# EAGLE design RAB_v11 (EAGLE 9.3.2)

## Sheet 1 of 5
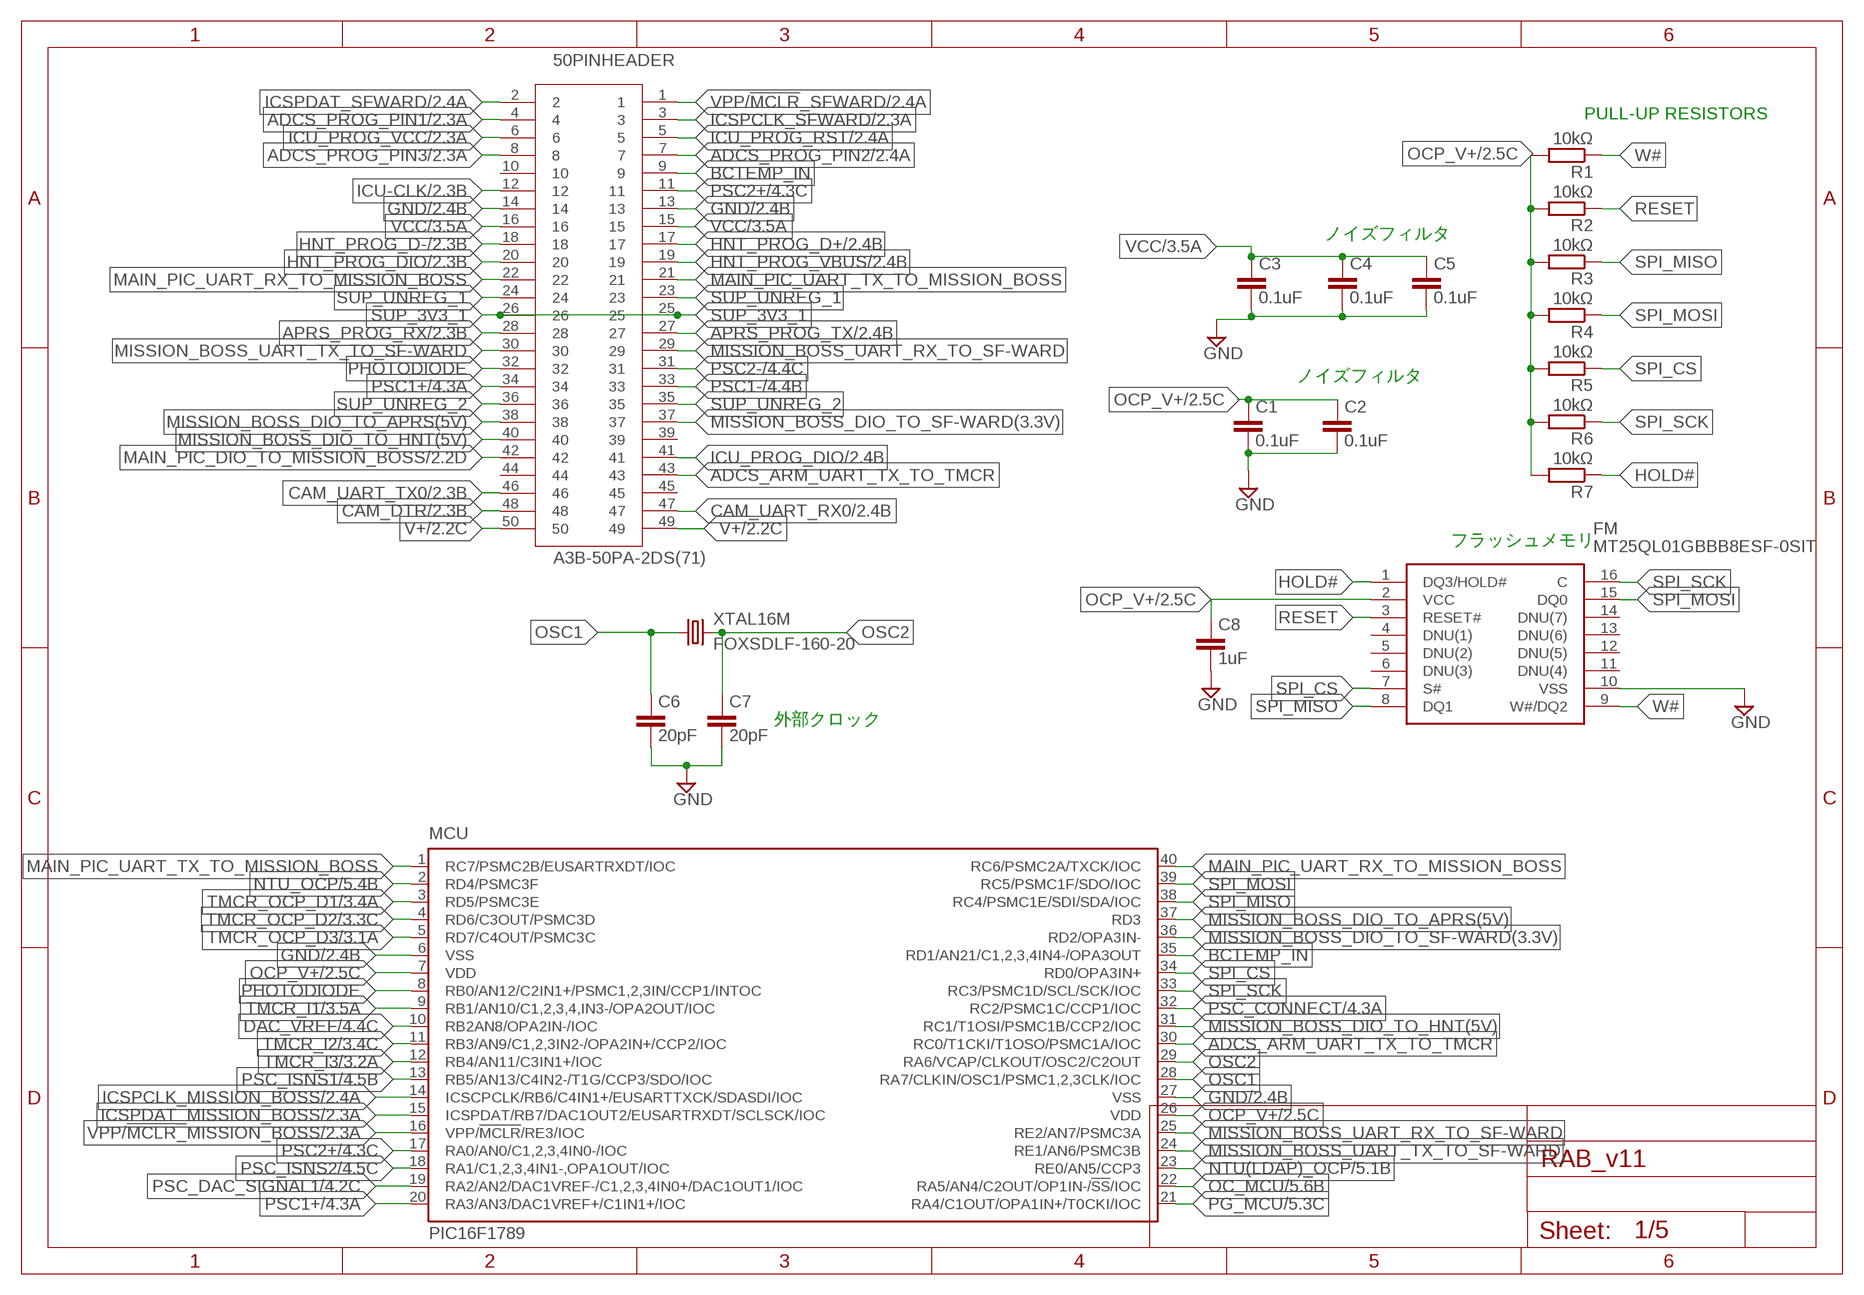
[diagram p0: schematic, sheet 1]

### Parts
50PINHEADER  A3B-50PA-2DS(71)  [A3B-50PA-2DS(71)]
C1  0.1uF  C-EUC0402  [C0402]
C2  0.1uF  C-EUC0402  [C0402]
C3  0.1uF  C-EUC0402  [C0402]
C4  0.1uF  C-EUC0402  [C0402]
C5  0.1uF  C-EUC0402  [C0402]
C6  20pF  C-EUC0402  [C0402]
C7  20pF  C-EUC0402  [C0402]
C8  1uF  C-EUC0402  [C0402]
FM  MT25QL01GBBB8ESF-0SIT  [SOIC127P1032X265-16N]
MCU  PIC16F1789  [UQFN40ML5X5MM]
R1  10kΩ  R-EU_R0805  [R0805]
R2  10kΩ  R-EU_R0805  [R0805]
R3  10kΩ  R-EU_R0805  [R0805]
R4  10kΩ  R-EU_R0805  [R0805]
R5  10kΩ  R-EU_R0805  [R0805]
R6  10kΩ  R-EU_R0805  [R0805]
R7  10kΩ  R-EU_R0805  [R0805]
XTAL16M  FOXSDLF-160-20  [FOXSDLF-160-20]

### Nets
ADCS_ARM_UART_TX_TO_TMCR: 50PINHEADER.43 MCU.30(RC0/T1CKI/T1OSO/PSMC1A/IOC)
ADCS_PROG_PIN1: 50PINHEADER.4 ; also sheet 2
ADCS_PROG_PIN2: 50PINHEADER.7 ; also sheet 2
ADCS_PROG_PIN3: 50PINHEADER.8 ; also sheet 2
APRS_PROG_RX: 50PINHEADER.28 ; also sheet 2
APRS_PROG_TX: 50PINHEADER.27 ; also sheet 2
BCTEMP_IN: 50PINHEADER.9 MCU.35(RD1/AN21/C1,2,3,4IN4-/OPA3OUT)
CAM_DTR: 50PINHEADER.48 ; also sheet 2
CAM_UART_RX0: 50PINHEADER.47 ; also sheet 2
CAM_UART_TX0: 50PINHEADER.46 ; also sheet 2
DAC_VREF: MCU.10(RB2AN8/OPA2IN-/IOC) ; also sheet 4
GND: 50PINHEADER.13 50PINHEADER.14 C1.2 C2.2 C3.2 C4.2 C5.2 C6.2 C7.2 C8.2 FM.10(VSS) MCU.6(VSS) MCU.27(VSS) ; also sheet 2,3,4,5
HNT_PROG_D+: 50PINHEADER.17 ; also sheet 2
HNT_PROG_D-: 50PINHEADER.18 ; also sheet 2
HNT_PROG_DIO: 50PINHEADER.20 ; also sheet 2
HNT_PROG_VBUS: 50PINHEADER.19 ; also sheet 2
HOLD#: FM.1(DQ3/HOLD#) R7.1
ICSPCLK_MISSION_BOSS: MCU.14(ICSCPCLK/RB6/C4IN1+/EUSARTTXCK/SDASDI/IOC) ; also sheet 2
ICSPCLK_SFWARD: 50PINHEADER.3 ; also sheet 2
ICSPDAT_MISSION_BOSS: MCU.15(ICSPDAT/RB7/DAC1OUT2/EUSARTRXDT/SCLSCK/IOC) ; also sheet 2
ICSPDAT_SFWARD: 50PINHEADER.2 ; also sheet 2
ICU-CLK: 50PINHEADER.12 ; also sheet 2
ICU_PROG_DIO: 50PINHEADER.41 ; also sheet 2
ICU_PROG_RST: 50PINHEADER.5 ; also sheet 2
ICU_PROG_VCC: 50PINHEADER.6 ; also sheet 2
MAIN_PIC_DIO_TO_MISSION_BOSS: 50PINHEADER.42 ; also sheet 2
MAIN_PIC_UART_RX_TO_MISSION_BOSS: 50PINHEADER.22 MCU.40(RC6/PSMC2A/TXCK/IOC)
MAIN_PIC_UART_TX_TO_MISSION_BOSS: 50PINHEADER.21 MCU.1(RC7/PSMC2B/EUSARTRXDT/IOC)
MISSION_BOSS_DIO_TO_APRS(5V): 50PINHEADER.38 MCU.37(RD3)
MISSION_BOSS_DIO_TO_HNT(5V): 50PINHEADER.40 MCU.31(RC1/T1OSI/PSMC1B/CCP2/IOC)
MISSION_BOSS_DIO_TO_SF-WARD(3.3V): 50PINHEADER.37 MCU.36(RD2/OPA3IN-)
MISSION_BOSS_UART_RX_TO_SF-WARD: 50PINHEADER.29 MCU.25(RE2/AN7/PSMC3A)
MISSION_BOSS_UART_TX_TO_SF-WARD: 50PINHEADER.30 MCU.24(RE1/AN6/PSMC3B)
NTU(LDAP)_OCP: MCU.23(RE0/AN5/CCP3) ; also sheet 5
NTU_OCP: MCU.2(RD4/PSMC3F) ; also sheet 5
OC_MCU: MCU.22(RA5/AN4/C2OUT/OP1IN-/!SS!/IOC) ; also sheet 5
OCP_V+: C1.1 C2.1 C8.1 FM.2(VCC) MCU.7(VDD) MCU.26(VDD) R1.2 R2.2 R3.2 R4.2 R5.2 R6.2 R7.2 ; also sheet 2,4,5
OSC1: C6.1 MCU.28(RA7/CLKIN/OSC1/PSMC1,2,3CLK/IOC) XTAL16M.1
OSC2: C7.1 MCU.29(RA6/VCAP/CLKOUT/OSC2/C2OUT) XTAL16M.2
PG_MCU: MCU.21(RA4/C1OUT/OPA1IN+/T0CKI/IOC) ; also sheet 5
PHOTODIODE: 50PINHEADER.32 MCU.8(RB0/AN12/C2IN1+/PSMC1,2,3IN/CCP1/INTOC)
PSC1+: 50PINHEADER.34 MCU.20(RA3/AN3/DAC1VREF+/C1IN1+/IOC) ; also sheet 4
PSC1-: 50PINHEADER.33 ; also sheet 4
PSC2+: 50PINHEADER.11 MCU.17(RA0/AN0/C1,2,3,4IN0-/IOC) ; also sheet 4
PSC2-: 50PINHEADER.31 ; also sheet 4
PSC_CONNECT: MCU.32(RC2/PSMC1C/CCP1/IOC) ; also sheet 4
PSC_DAC_SIGNAL1: MCU.19(RA2/AN2/DAC1VREF-/C1,2,3,4IN0+/DAC1OUT1/IOC) ; also sheet 4
PSC_ISNS1: MCU.13(RB5/AN13/C4IN2-/T1G/CCP3/SDO/IOC) ; also sheet 4
PSC_ISNS2: MCU.18(RA1/C1,2,3,4IN1-,OPA1OUT/IOC) ; also sheet 4
RESET: FM.3(RESET#) R2.1
SPI_CS: FM.7(S#) MCU.34(RD0/OPA3IN+) R5.1
SPI_MISO: FM.8(DQ1) MCU.38(RC4/PSMC1E/SDI/SDA/IOC) R3.1
SPI_MOSI: FM.15(DQ0) MCU.39(RC5/PSMC1F/SDO/IOC) R4.1
SPI_SCK: FM.16(C) MCU.33(RC3/PSMC1D/SCL/SCK/IOC) R6.1
SUP_3V3_1: 50PINHEADER.25 50PINHEADER.26
SUP_UNREG_1: 50PINHEADER.23 50PINHEADER.24
SUP_UNREG_2: 50PINHEADER.35 50PINHEADER.36
TMCR_I1: MCU.9(RB1/AN10/C1,2,3,4,IN3-/OPA2OUT/IOC) ; also sheet 3
TMCR_I2: MCU.11(RB3/AN9/C1,2,3IN2-/OPA2IN+/CCP2/IOC) ; also sheet 3
TMCR_I3: MCU.12(RB4/AN11/C3IN1+/IOC) ; also sheet 3
TMCR_OCP_D1: MCU.3(RD5/PSMC3E) ; also sheet 3
TMCR_OCP_D2: MCU.4(RD6/C3OUT/PSMC3D) ; also sheet 3
TMCR_OCP_D3: MCU.5(RD7/C4OUT/PSMC3C) ; also sheet 3
V+: 50PINHEADER.49 50PINHEADER.50 ; also sheet 2
VCC: 50PINHEADER.15 50PINHEADER.16 C3.1 C4.1 C5.1 ; also sheet 3,5
VPP/!MCLR!_MISSION_BOSS: MCU.16(VPP/!MCLR!/RE3/IOC) ; also sheet 2
VPP/!MCLR!_SFWARD: 50PINHEADER.1 ; also sheet 2
W#: FM.9(W#/DQ2) R1.1
Unconnected: 50PINHEADER.10 50PINHEADER.39 50PINHEADER.44 50PINHEADER.45 FM.4(DNU(1)) FM.5(DNU(2)) FM.6(DNU(3)) FM.11(DNU(4)) FM.12(DNU(5)) FM.13(DNU(6)) FM.14(DNU(7))

### Notes on the sheet
- PULL-UP RESISTORS
- ノイズフィルタ
- ノイズフィルタ
- フラッシュメモリ
- 外部クロック

## Sheet 2 of 5
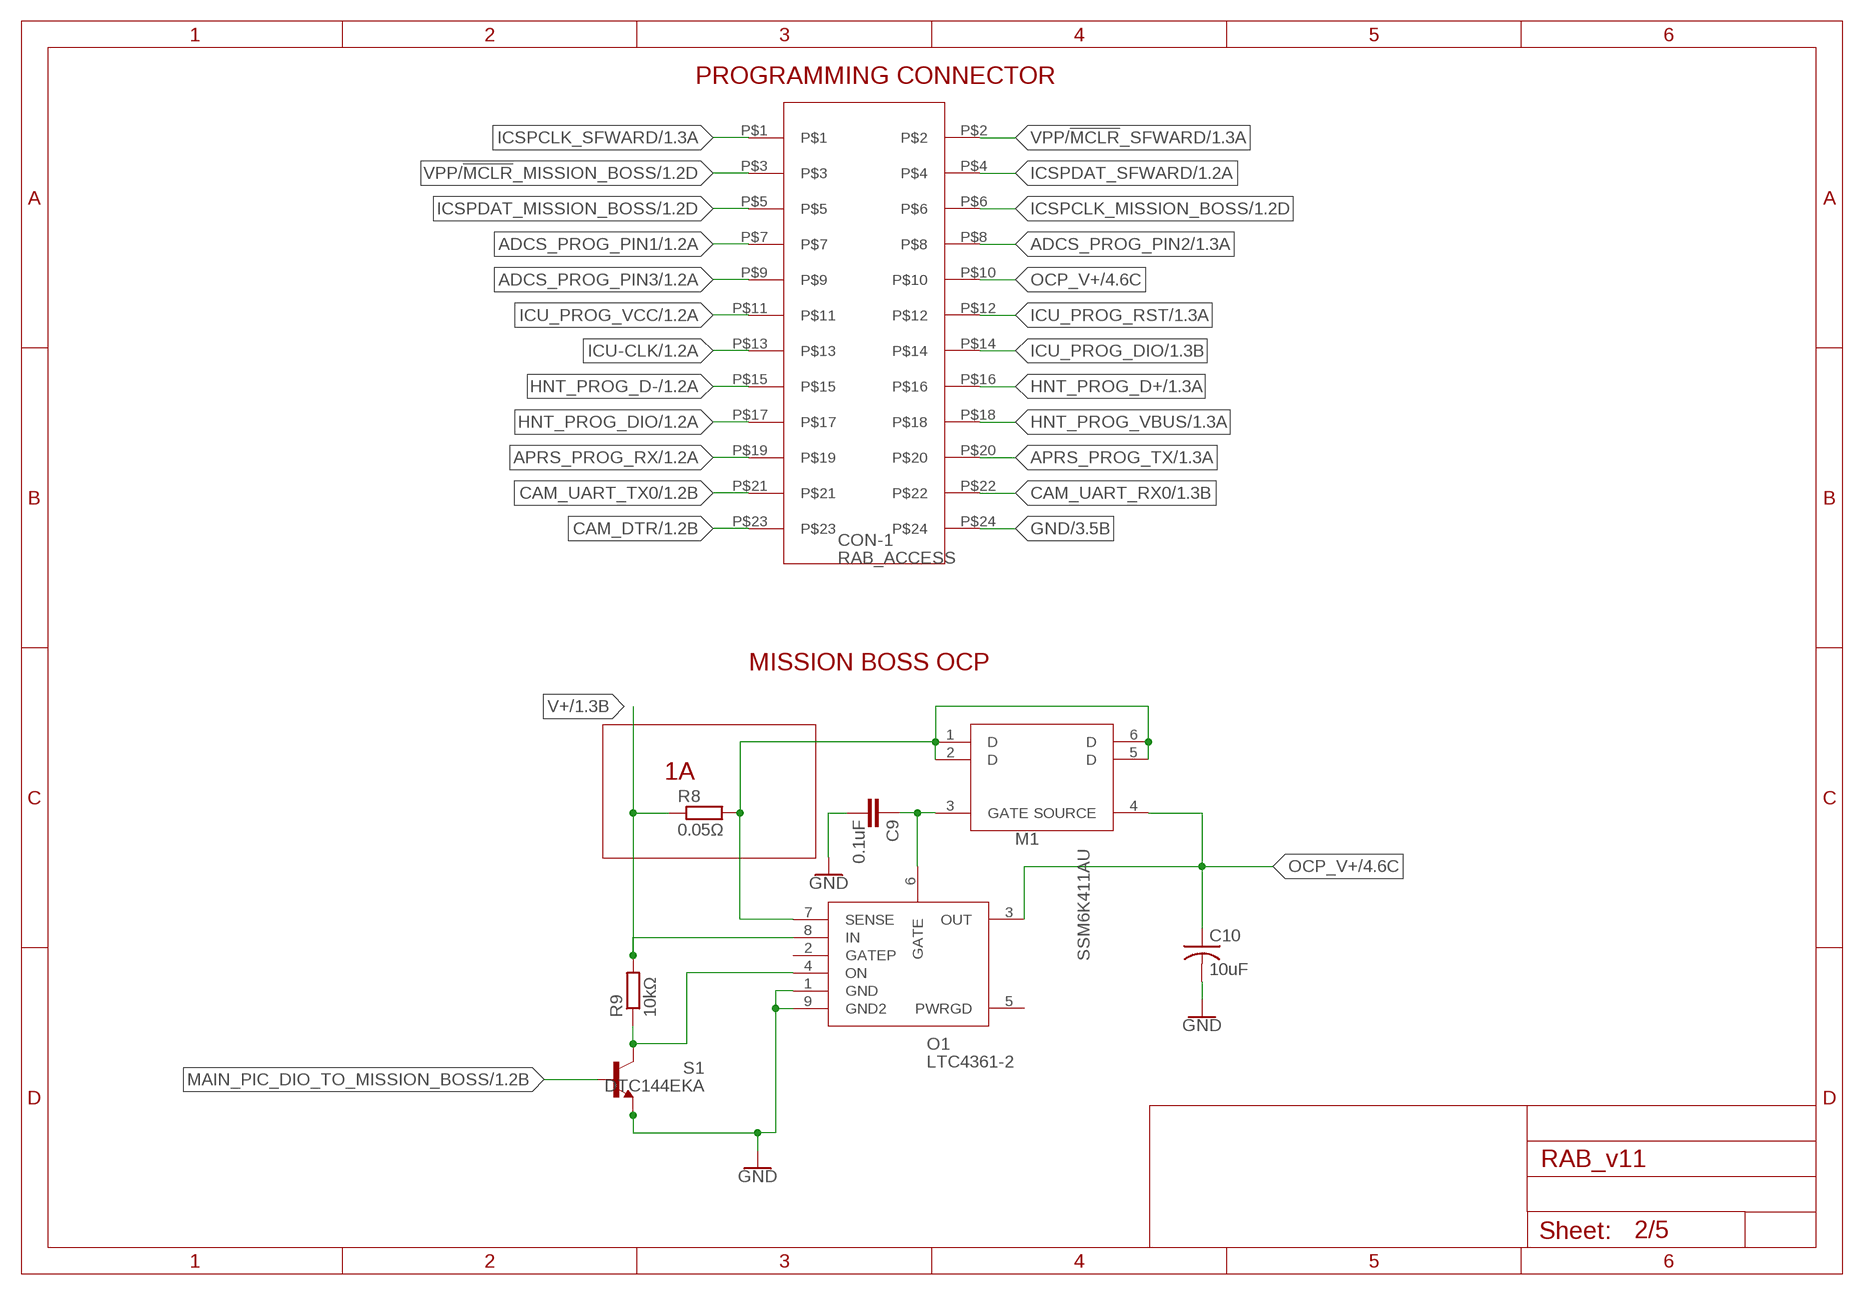
[diagram p1: schematic, sheet 2]

### Parts
C9  0.1uF  C-EUC0402  [C0402]
C10  10uF  C-USC0805  [C0805]
CON-1  RAB_ACCESS  [RAB_ACCESS]
M1  SSM6K411TU  [SSM6K411TU]
O1  LTC4361-2  [DFN]
R8  0.05Ω  R-EU_R0805  [R0805]
R9  10kΩ  R-EU_R0805  [R0805]
S1  DTC144EKA  [SOT346-R]

### Nets
ADCS_PROG_PIN1: CON-1.P$7 ; also sheet 1
ADCS_PROG_PIN2: CON-1.P$8 ; also sheet 1
ADCS_PROG_PIN3: CON-1.P$9 ; also sheet 1
APRS_PROG_RX: CON-1.P$19 ; also sheet 1
APRS_PROG_TX: CON-1.P$20 ; also sheet 1
CAM_DTR: CON-1.P$23 ; also sheet 1
CAM_UART_RX0: CON-1.P$22 ; also sheet 1
CAM_UART_TX0: CON-1.P$21 ; also sheet 1
GND: C9.2 C10.2 CON-1.P$24 O1.1(GND) O1.9(GND2) S1.1(E) ; also sheet 1,3,4,5
HNT_PROG_D+: CON-1.P$16 ; also sheet 1
HNT_PROG_D-: CON-1.P$15 ; also sheet 1
HNT_PROG_DIO: CON-1.P$17 ; also sheet 1
HNT_PROG_VBUS: CON-1.P$18 ; also sheet 1
ICSPCLK_MISSION_BOSS: CON-1.P$6 ; also sheet 1
ICSPCLK_SFWARD: CON-1.P$1 ; also sheet 1
ICSPDAT_MISSION_BOSS: CON-1.P$5 ; also sheet 1
ICSPDAT_SFWARD: CON-1.P$4 ; also sheet 1
ICU-CLK: CON-1.P$13 ; also sheet 1
ICU_PROG_DIO: CON-1.P$14 ; also sheet 1
ICU_PROG_RST: CON-1.P$12 ; also sheet 1
ICU_PROG_VCC: CON-1.P$11 ; also sheet 1
MAIN_PIC_DIO_TO_MISSION_BOSS: S1.2(B) ; also sheet 1
N$26: C9.1 M1.3(GATE) O1.6(GATE)
OCP_V+: C10.1 CON-1.P$10 M1.4(SOURCE) O1.3(OUT) ; also sheet 1,4,5
ON4: O1.4(ON) R9.1 S1.3(C)
SENSE4: M1.1(D) M1.2(D) M1.5(D) M1.6(D) O1.7(SENSE) R8.2
V+: O1.8(IN) R8.1 R9.2 ; also sheet 1
VPP/!MCLR!_MISSION_BOSS: CON-1.P$3 ; also sheet 1
VPP/!MCLR!_SFWARD: CON-1.P$2 ; also sheet 1
Unconnected: O1.2(GATEP) O1.5(PWRGD)

### Notes on the sheet
- PROGRAMMING CONNECTOR
- MISSION BOSS OCP
- 1A

## Sheet 3 of 5: TMCR
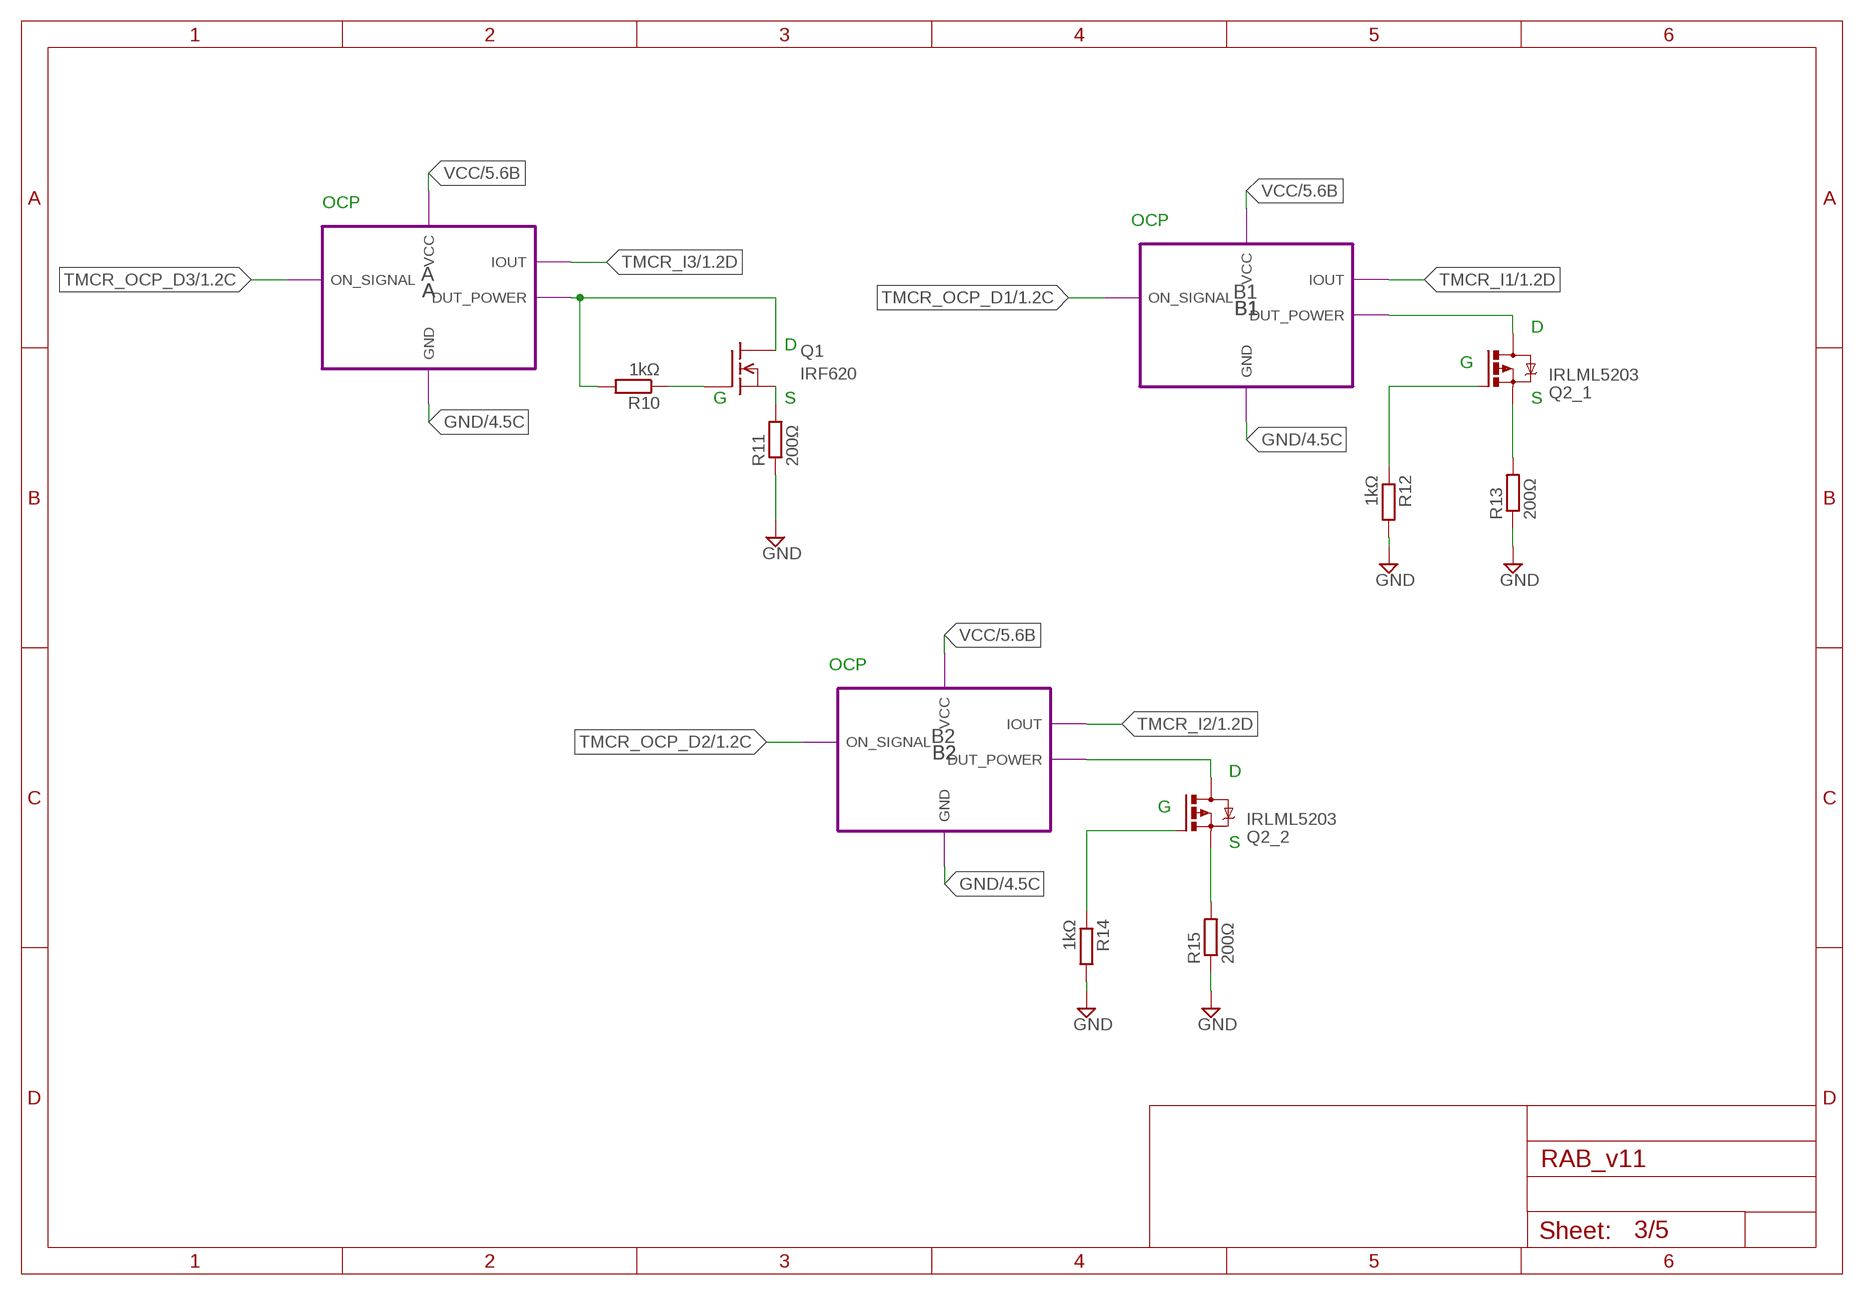
[diagram p2: schematic, sheet 3]

### Parts
Q1  IRF620  [TO220]
Q2_1  IRLML5203  [MICRO3]
Q2_2  IRLML5203  [MICRO3]
R10  1kΩ  R-EU_R0805  [R0805]
R11  200Ω  R-EU_R0805  [R0805]
R12  1kΩ  R-EU_R0805  [R0805]
R13  200Ω  R-EU_R0805  [R0805]
R14  1kΩ  R-EU_R0805  [R0805]
R15  200Ω  R-EU_R0805  [R0805]

### Module instances
A = OCP
B1 = OCP
B2 = OCP

### Nets
GND: R11.1 R12.2 R13.1 R14.2 R15.1 ; port A.GND B1.GND B2.GND ; also sheet 1,2,4,5
N$1: Q2_1.2(S) R13.2
N$2: Q2_1.1(G) R12.1
N$6: Q2_2.3(D) ; port B2.DUT_POWER
N$10: Q2_2.2(S) R15.2
N$13: Q2_2.1(G) R14.1
N$15: Q1.2(D) R10.2 ; port A.DUT_POWER
N$16: Q1.3(S) R11.2
N$17: Q1.1(G) R10.1
N$18: Q2_1.3(D) ; port B1.DUT_POWER
TMCR_I1: port B1.IOUT ; also sheet 1
TMCR_I2: port B2.IOUT ; also sheet 1
TMCR_I3: port A.IOUT ; also sheet 1
TMCR_OCP_D1: port B1.ON_SIGNAL ; also sheet 1
TMCR_OCP_D2: port B2.ON_SIGNAL ; also sheet 1
TMCR_OCP_D3: port A.ON_SIGNAL ; also sheet 1
VCC: port A.VCC B1.VCC B2.VCC ; also sheet 1,5

### Notes on the sheet
- OCP
- OCP
- D
- D
- G
- G | S | S
- OCP
- D
- G
- S

## Sheet 4 of 5: PSC
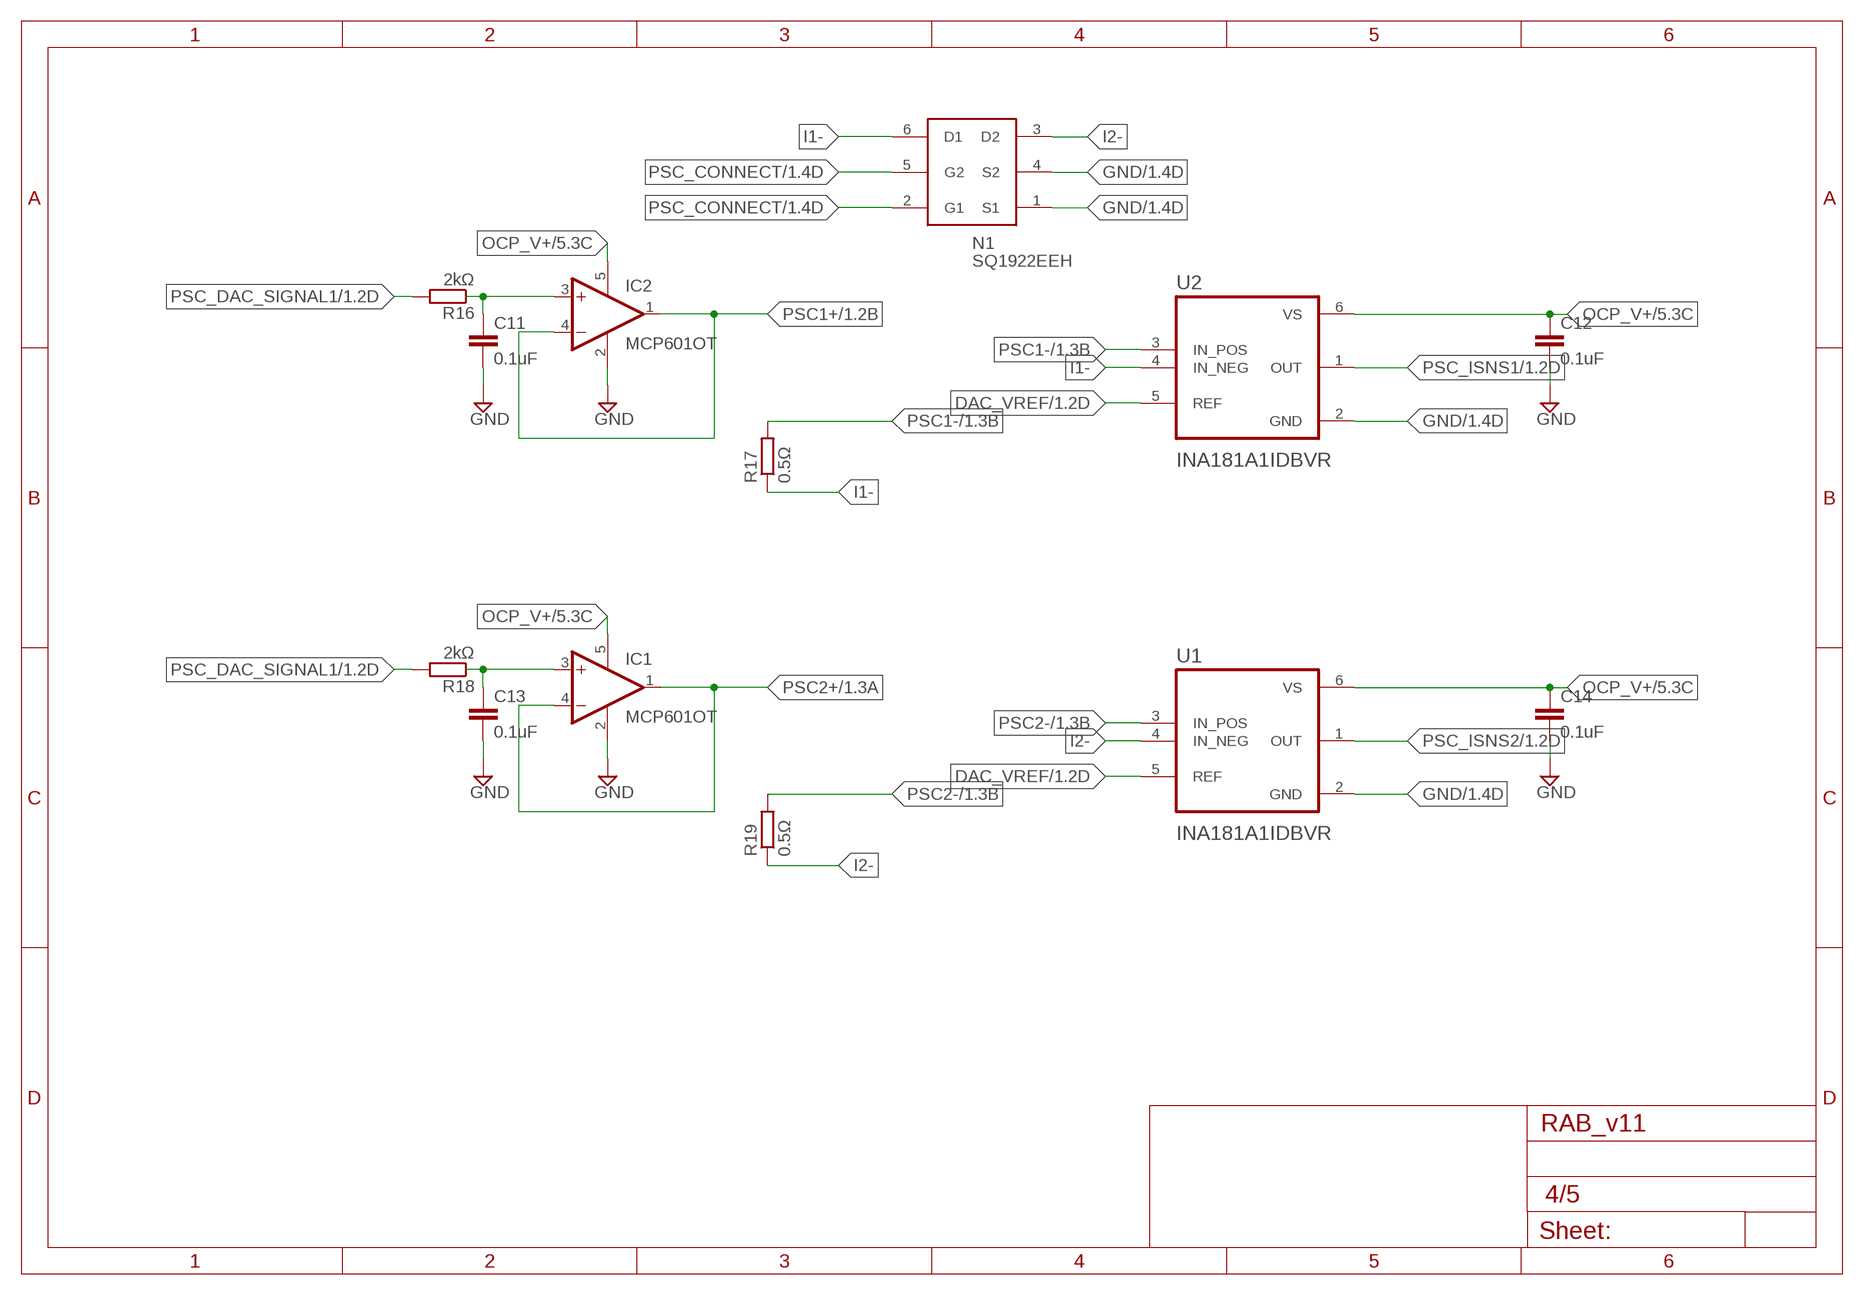
[diagram p3: schematic, sheet 4]

### Parts
C11  0.1uF  C-EUC0402  [C0402]
C12  0.1uF  C-EUC0402  [C0402]
C13  0.1uF  C-EUC0402  [C0402]
C14  0.1uF  C-EUC0402  [C0402]
IC1  MCP601OT  [SOT23-5]
IC2  MCP601OT  [SOT23-5]
N1  SQ1922EEH  [SOT65P210X110-6N]
R16  2kΩ  R-EU_R0805  [R0805]
R17  0.5Ω  R-EU_R0805  [R0805]
R18  2kΩ  R-EU_R0805  [R0805]
R19  0.5Ω  R-EU_R0805  [R0805]
U1  INA181A1IDBVR  [SOT95P280X145-6N]
U2  INA181A1IDBVR  [SOT95P280X145-6N]

### Nets
DAC_VREF: U1.5(REF) U2.5(REF) ; also sheet 1
GND: C11.2 C12.2 C13.2 C14.2 IC1.2(V-) IC2.2(V-) N1.1(S1) N1.4(S2) U1.2(GND) U2.2(GND) ; also sheet 1,2,3,5
I1-: N1.6(D1) R17.1 U2.4(IN_NEG)
I2-: N1.3(D2) R19.1 U1.4(IN_NEG)
N$3: C13.1 IC1.3(+IN) R18.1
N$4: C11.1 IC2.3(+IN) R16.1
OCP_V+: C12.1 C14.1 IC1.5(V+) IC2.5(V+) U1.6(VS) U2.6(VS) ; also sheet 1,2,5
PSC1+: IC2.1(OUT) IC2.4(-IN) ; also sheet 1
PSC1-: R17.2 U2.3(IN_POS) ; also sheet 1
PSC2+: IC1.1(OUT) IC1.4(-IN) ; also sheet 1
PSC2-: R19.2 U1.3(IN_POS) ; also sheet 1
PSC_CONNECT: N1.2(G1) N1.5(G2) ; also sheet 1
PSC_DAC_SIGNAL1: R16.2 R18.2 ; also sheet 1
PSC_ISNS1: U2.1(OUT) ; also sheet 1
PSC_ISNS2: U1.1(OUT) ; also sheet 1

## Sheet 5 of 5: NTU
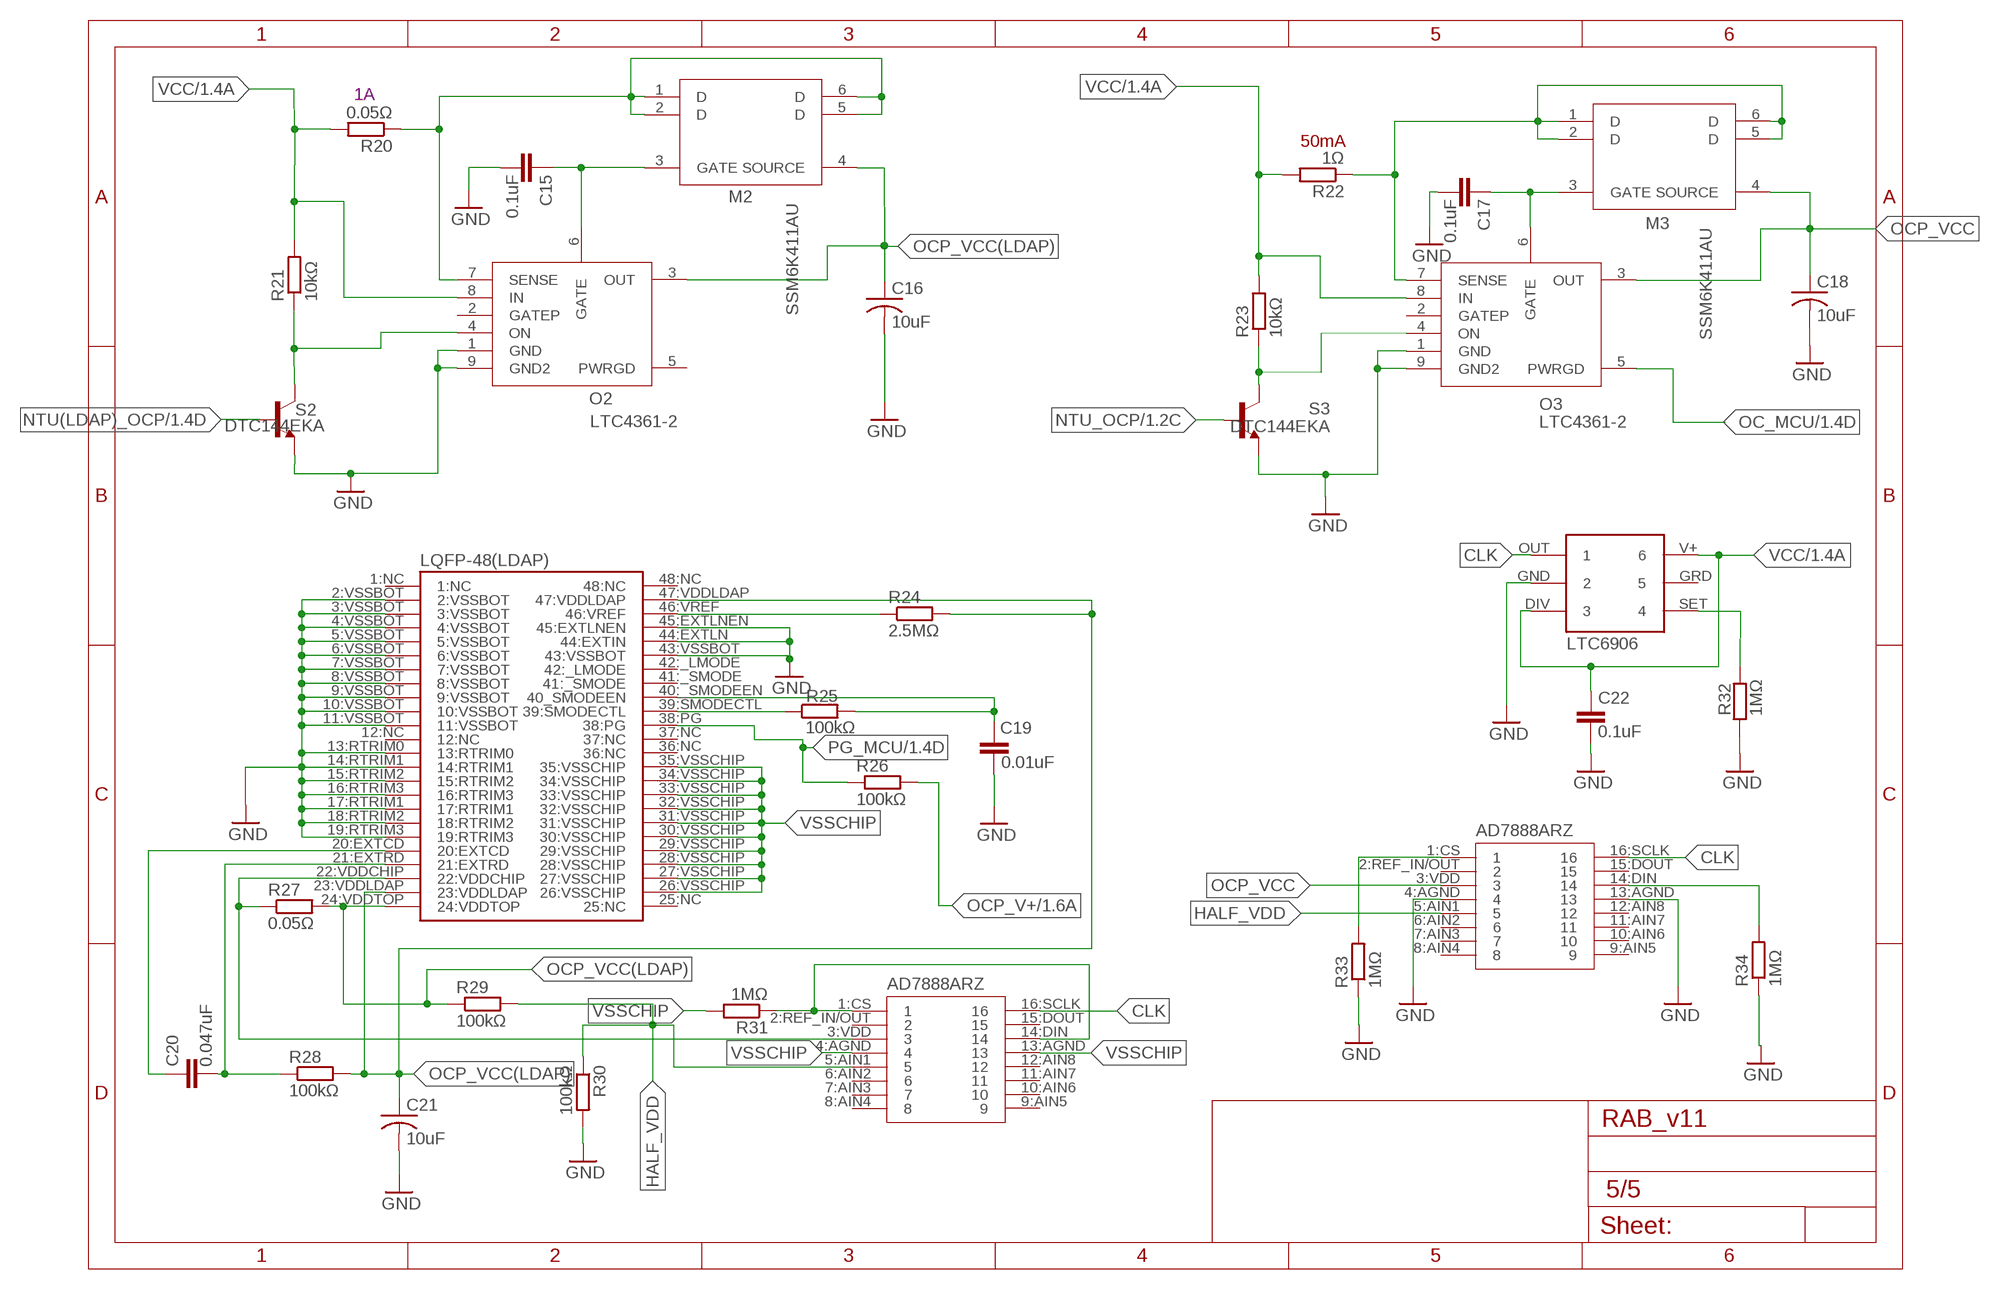
[diagram p4: schematic, sheet 5]

### Parts
ADC1  AD7888ARZ  [AD7888ARZ]
ADC2  AD7888ARZ  [AD7888ARZ]
C15  0.1uF  C-EUC0402  [C0402]
C16  10uF  C-USC0805  [C0805]
C17  0.1uF  C-EUC0402  [C0402]
C18  10uF  C-USC0805  [C0805]
C19  0.01uF  C-EUC0402  [C0402]
C20  0.047uF  C-EUC0402  [C0402]
C21  10uF  C-USC0805  [C0805]
C22  0.1uF  C-EUC0402  [C0402]
CLCK  LTC6906  [LTC6906]
LDAP  LQFP-48  [LQFP-48]
M2  SSM6K411TU  [SSM6K411TU]
M3  SSM6K411TU  [SSM6K411TU]
O2  LTC4361-2  [DFN]
O3  LTC4361-2  [DFN]
R20  0.05Ω  R-EU_R0805  [R0805]
R21  10kΩ  R-EU_R0805  [R0805]
R22  1Ω  R-EU_R0805  [R0805]
R23  10kΩ  R-EU_R0805  [R0805]
R24  2.5MΩ  R-EU_R0805  [R0805]
R25  100kΩ  R-EU_R0805  [R0805]
R26  100kΩ  R-EU_R0805  [R0805]
R27  0.05Ω  R-EU_R0805  [R0805]
R28  100kΩ  R-EU_R0805  [R0805]
R29  100kΩ  R-EU_R0805  [R0805]
R30  100kΩ  R-EU_R0805  [R0805]
R31  1MΩ  R-EU_R0805  [R0805]
R32  1MΩ  R-EU_R0805  [R0805]
R33  1MΩ  R-EU_R0805  [R0805]
R34  1MΩ  R-EU_R0805  [R0805]
S2  DTC144EKA  [SOT346-R]
S3  DTC144EKA  [SOT346-R]

### Nets
CLK: ADC1.16:SCLK ADC2.16:SCLK CLCK.OUT
GND: ADC2.4:AGND ADC2.13:AGND C15.2 C16.2 C17.2 C18.2 C19.2 C21.2 C22.2 CLCK.GND LDAP.2:VSSBOT LDAP.3:VSSBOT LDAP.4:VSSBOT LDAP.5:VSSBOT LDAP.6:VSSBOT LDAP.7:VSSBOT LDAP.8:VSSBOT LDAP.9:VSSBOT LDAP.10:VSSBOT LDAP.11:VSSBOT LDAP.13:RTRIM0 LDAP.14:RTRIM1 LDAP.15:RTRIM2 LDAP.16:RTRIM3 LDAP.17:RTRIM1 LDAP.18:RTRIM2 LDAP.19:RTRIM3 LDAP.43:VSSBOT LDAP.44:EXTLN(44:EXTIN) LDAP.45:EXTLNEN O2.1(GND) O2.9(GND2) O3.1(GND) O3.9(GND2) R30.2 R32.1 R33.1 R34.1 S2.1(E) S3.1(E) ; also sheet 1,2,3,4
HALF_VDD: ADC1.5:AIN1 ADC2.5:AIN1 R29.2 R30.1
N$5: ADC2.1:CS R33.2
N$7: CLCK.SET R32.2
N$8: ADC2.14:DIN R34.2
N$9: O3.4(ON) R23.1 S3.3(C)
N$11: C17.1 M3.3(GATE) O3.6(GATE)
N$12: ADC1.1:CS ADC1.14:DIN R31.1
N$19: LDAP.39:SMODECTL R25.1
N$20: C19.1 LDAP.40:_SMODEEN(40_SMODEEN) R25.2
N$21: M3.1(D) M3.2(D) M3.5(D) M3.6(D) O3.7(SENSE) R22.1
N$22: C15.1 M2.3(GATE) O2.6(GATE)
N$23: M2.1(D) M2.2(D) M2.5(D) M2.6(D) O2.7(SENSE) R20.1
N$27: LDAP.46:VREF R24.1
N$28: C20.1 LDAP.20:EXTCD
N$29: O2.4(ON) R21.1 S2.3(C)
N$31: ADC1.3:VDD LDAP.22:VDDCHIP R27.1
N$32: C20.2 LDAP.21:EXTRD R28.1
NTU(LDAP)_OCP: S2.2(B) ; also sheet 1
NTU_OCP: S3.2(B) ; also sheet 1
OC_MCU: O3.5(PWRGD) ; also sheet 1
OCP_V+: R26.2 ; also sheet 1,2,4
OCP_VCC: ADC2.3:VDD C18.1 M3.4(SOURCE) O3.3(OUT)
OCP_VCC(LDAP): C16.1 C21.1 LDAP.23:VDDLDAP LDAP.24:VDDTOP LDAP.47:VDDLDAP M2.4(SOURCE) O2.3(OUT) R24.2 R27.2 R28.2 R29.1
PG_MCU: LDAP.38:PG R26.1 ; also sheet 1
VCC: C22.1 CLCK.DIV CLCK.V+ O2.8(IN) O3.8(IN) R20.2 R21.2 R22.2 R23.2 ; also sheet 1,3
VSSCHIP: ADC1.4:AGND ADC1.13:AGND LDAP.26:VSSCHIP LDAP.27:VSSCHIP LDAP.28:VSSCHIP LDAP.29:VSSCHIP LDAP.30:VSSCHIP LDAP.31:VSSCHIP LDAP.32:VSSCHIP LDAP.33:VSSCHIP LDAP.34:VSSCHIP LDAP.35:VSSCHIP R31.2
Unconnected: ADC1.2:REF_IN/OUT ADC1.6:AIN2 ADC1.7:AIN3 ADC1.8:AIN4 ADC1.9:AIN5 ADC1.10:AIN6 ADC1.11:AIN7 ADC1.12:AIN8 ADC1.15:DOUT ADC2.2:REF_IN/OUT ADC2.6:AIN2 ADC2.7:AIN3 ADC2.8:AIN4 ADC2.9:AIN5 ADC2.10:AIN6 ADC2.11:AIN7 ADC2.12:AIN8 ADC2.15:DOUT CLCK.GRD LDAP.1:NC LDAP.12:NC LDAP.25:NC LDAP.36:NC LDAP.37:NC LDAP.41:_SMODE LDAP.42:_LMODE LDAP.48:NC O2.2(GATEP) O2.5(PWRGD) O3.2(GATEP)

### Notes on the sheet
- 1A
- 50mA

## Library data of the parts
50PINHEADER = BIRDS3_Tha_lib:A3B-50PA-2DS(71)
ADC1 ADC2 = AD7888ARZ:AD7888ARZ
C1-C9 C11-C15 C17 C19 C22 = rcl:C-EU: CAPACITOR, European symbol; SPICEPREFIX: C
C10 C16 C18 C21 = rcl:C-US: CAPACITOR, American symbol; SPICEPREFIX: C
C20 = resistor:C-EU: CAPACITOR, European symbol
CLCK = LTC6906:LTC6906
CON-1 = BIRDS_4_general_components_library:RAB_ACCESS
FM = BIRDS3_CAM_MSN:MT25QL01GBBB8ESF-0SIT: IC FLASH 1GBIT 108MHZ 16SOIC Source: Datasheet <https://www.micron.com/~/media/documents/products/data-sheet/nor-flash/serial-nor/mt25q/die-rev-b/mt25q_qlkt_l_01g_bbb_0.pdf>; DESCRIPTION: IC FLASH 1GBIT 108MHZ 16SOIC; HEIGHT: 2.65mm; MANUFACTURER_NAME: Micron; MANUFACTURER_PART_NUMBER: MT25QL01GBBB8ESF-0SIT; SUPPLIER_NAME: RS
IC1 IC2 = linear:MCP601: Single Op Amp 2.7V to 6.0V Single Supply CMOS Source: http://ww1.microchip.com/downloads/en/DeviceDoc/21314g.pdf
LDAP = LQFP-48:LQFP-48
M1-M3 = BIRDS3_Tha_lib:SSM6K411TU
MCU = microchip_edited:PIC16F1789
N1 = BIRDS3_CAM_MSN:SQ1922EEH
O1-O3 = BIRDS3_CAM_MSN:LTC4361-2
Q1 = transistor-fet:IRF620: N-Channel Enhancement MOSFET (HEXFET); 200V; 5,2A; 0,8Ohm
Q2_1 Q2_2 = transistor-power:IRLML5203: HEXFET P-Channel Power MOSFET
R1-R34 = rcl:R-EU_: RESISTOR, European symbol; SPICEPREFIX: R
S1-S3 = BIRDS3_CAM_MSN:DTC144EKA
U1 U2 = INA181A1IDBVR:INA181A1IDBVR: 26V, Bidirectional, Low- or High-Side Voltage Output Current Sense Amplifier 6-SOT-23 -40 to 125; DESCRIPTION: 26V, Bidirectional, Low- or High-Side Voltage Output Current Sense Amplifier 6-SOT-23 -40 to 125; DIGI-KEY_PART_NUMBER: 296-47656-1-ND; DIGI-KEY_PURCHASE_URL: https://www.digikey.com/product-detail/en/texas-instruments/INA181A1IDBVR/296-47656-1-ND/8133025?utm_source=snapeda&utm_medium=aggregator&utm_campaign=symbol; MF: Texas Instruments; MP: INA181A1IDBVR; PACKAGE: SOT-23 Texas Instruments
XTAL16M = BIRDS3_CAM_MSN:FOXSDLF-160-20

## Module OCP
Ports: VCC(pwr) GND(pwr) ON_SIGNAL(in) IOUT(out) DUT_POWER(out)
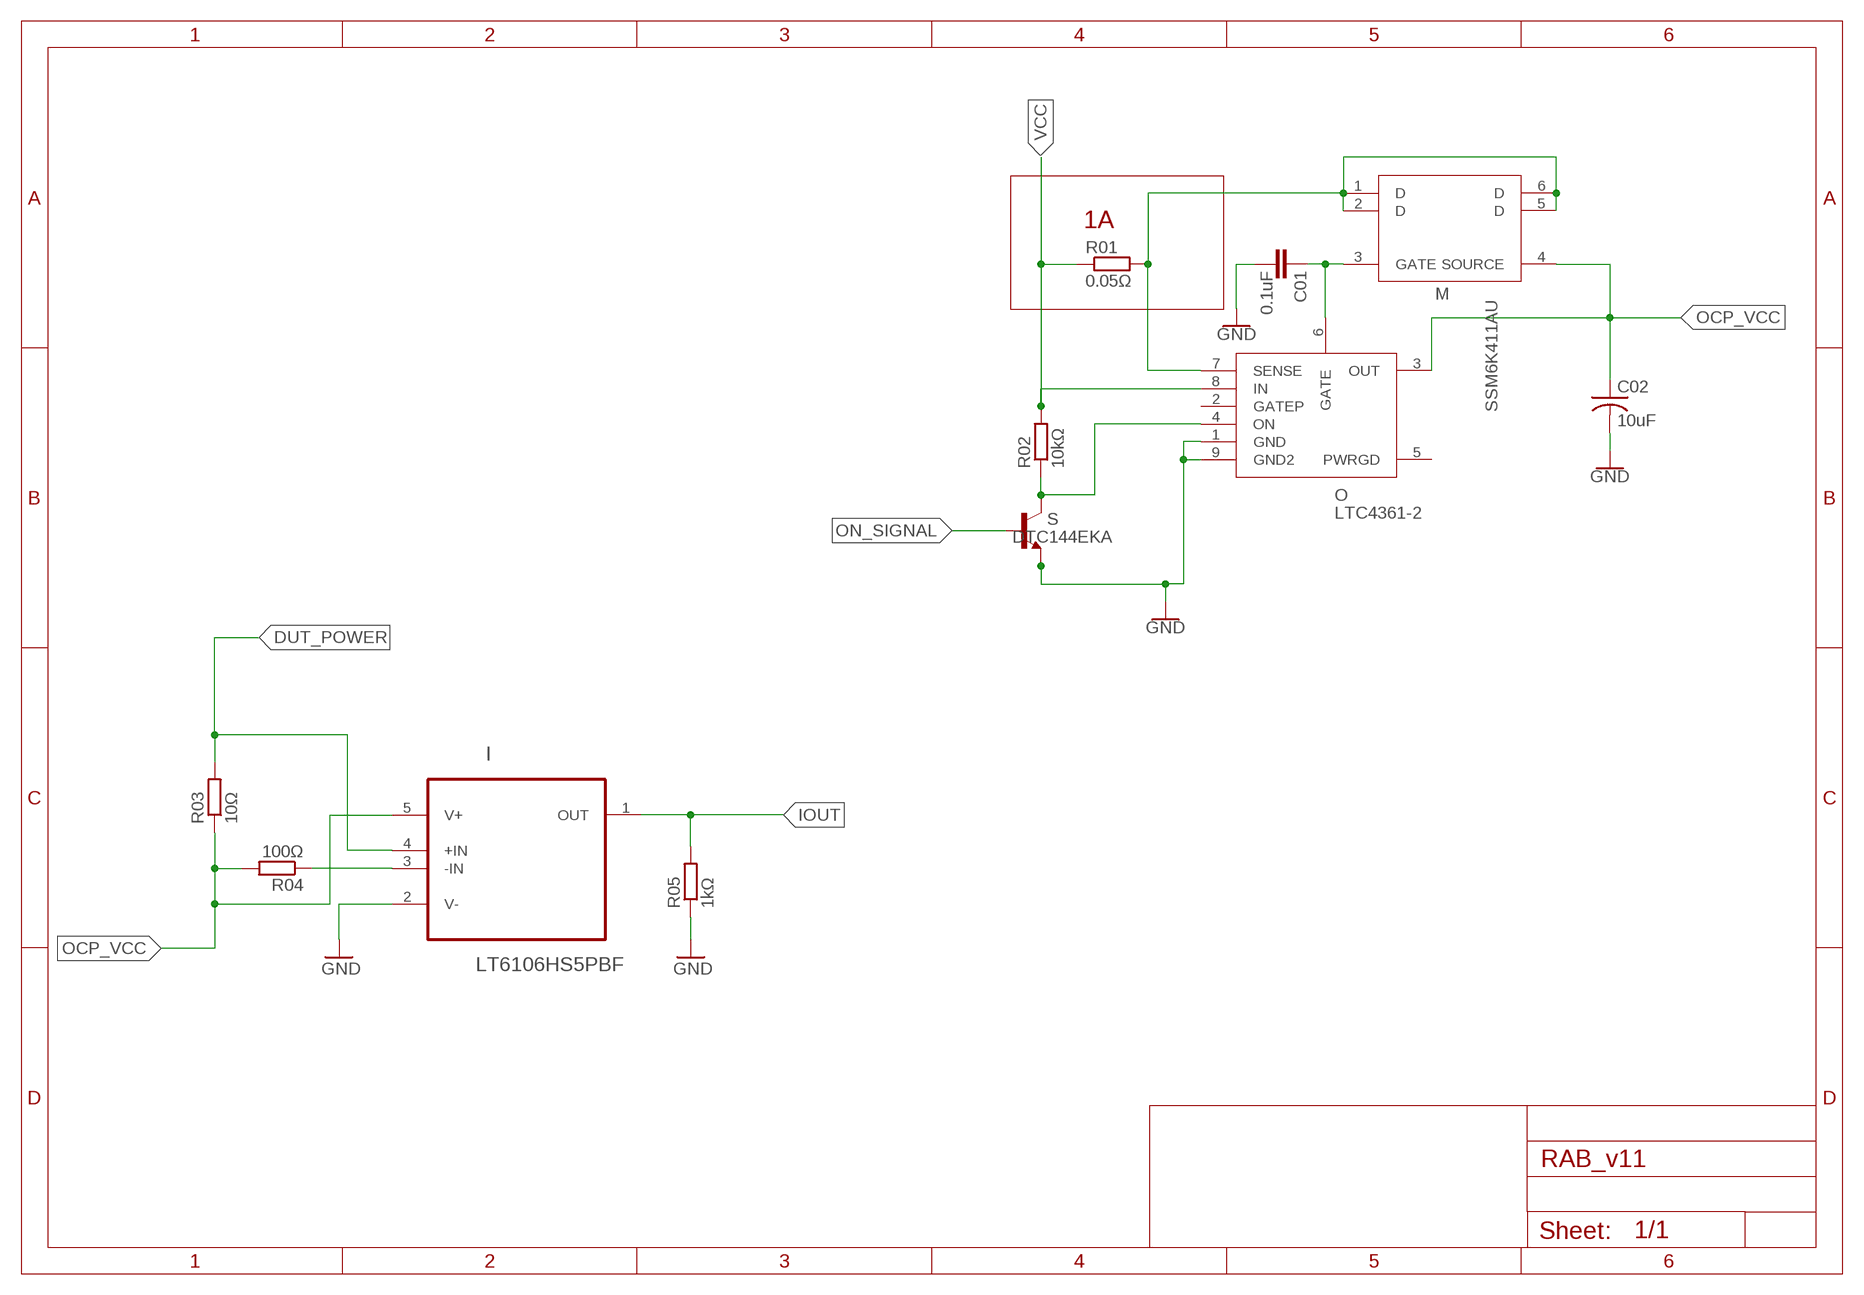
[diagram p5: schematic, module OCP, sheet 1]

### Parts
C01  0.1uF  C-EUC0402  [C0402]
C02  10uF  C-USC0805  [C0805]
I  LT6106HS5PBF  [SOT95P280X100-5N]
M  SSM6K411TU  [SSM6K411TU]
O  LTC4361-2  [DFN]
R01  0.05Ω  R-EU_R0805  [R0805]
R02  10kΩ  R-EU_R0805  [R0805]
R03  10Ω  R-EU_R0805  [R0805]
R04  100Ω  R-EU_R0805  [R0805]
R05  1kΩ  R-EU_R0805  [R0805]
S  DTC144EKA  [SOT346-R]

### Nets
DUT_POWER: I.4(+IN) R03.2
GND: C01.2 C02.2 I.2(V-) O.1(GND) O.9(GND2) R05.1 S.1(E)
IOUT: I.1(OUT) R05.2
N$2: I.3(-IN) R04.1
N$3: C01.1 M.3(GATE) O.6(GATE)
OCP_VCC: C02.1 I.5(V+) M.4(SOURCE) O.3(OUT) R03.1 R04.2
ON4: O.4(ON) R02.1 S.3(C)
ON_SIGNAL: S.2(B)
SENSE4: M.1(D) M.2(D) M.5(D) M.6(D) O.7(SENSE) R01.2
VCC: O.8(IN) R01.1 R02.2
Unconnected: O.2(GATEP) O.5(PWRGD)

### Notes on the sheet
- 1A

### Library data of the parts
C01 = rcl:C-EU: CAPACITOR, European symbol; SPICEPREFIX: C
C02 = rcl:C-US: CAPACITOR, American symbol; SPICEPREFIX: C
I = LTC_By_element14_Batch_1:LT6106HS5PBF: High Side Current Sense; MPN: LT6106HS5#PBF; OC_FARNELL: 1432117; OC_NEWARK: 61R9528; PACKAGE: TSOT-23-5; SUPPLIER: Linear Technology
M = BIRDS3_Tha_lib:SSM6K411TU
O = BIRDS3_CAM_MSN:LTC4361-2
R01-R05 = rcl:R-EU_: RESISTOR, European symbol; SPICEPREFIX: R
S = BIRDS3_CAM_MSN:DTC144EKA

## Board
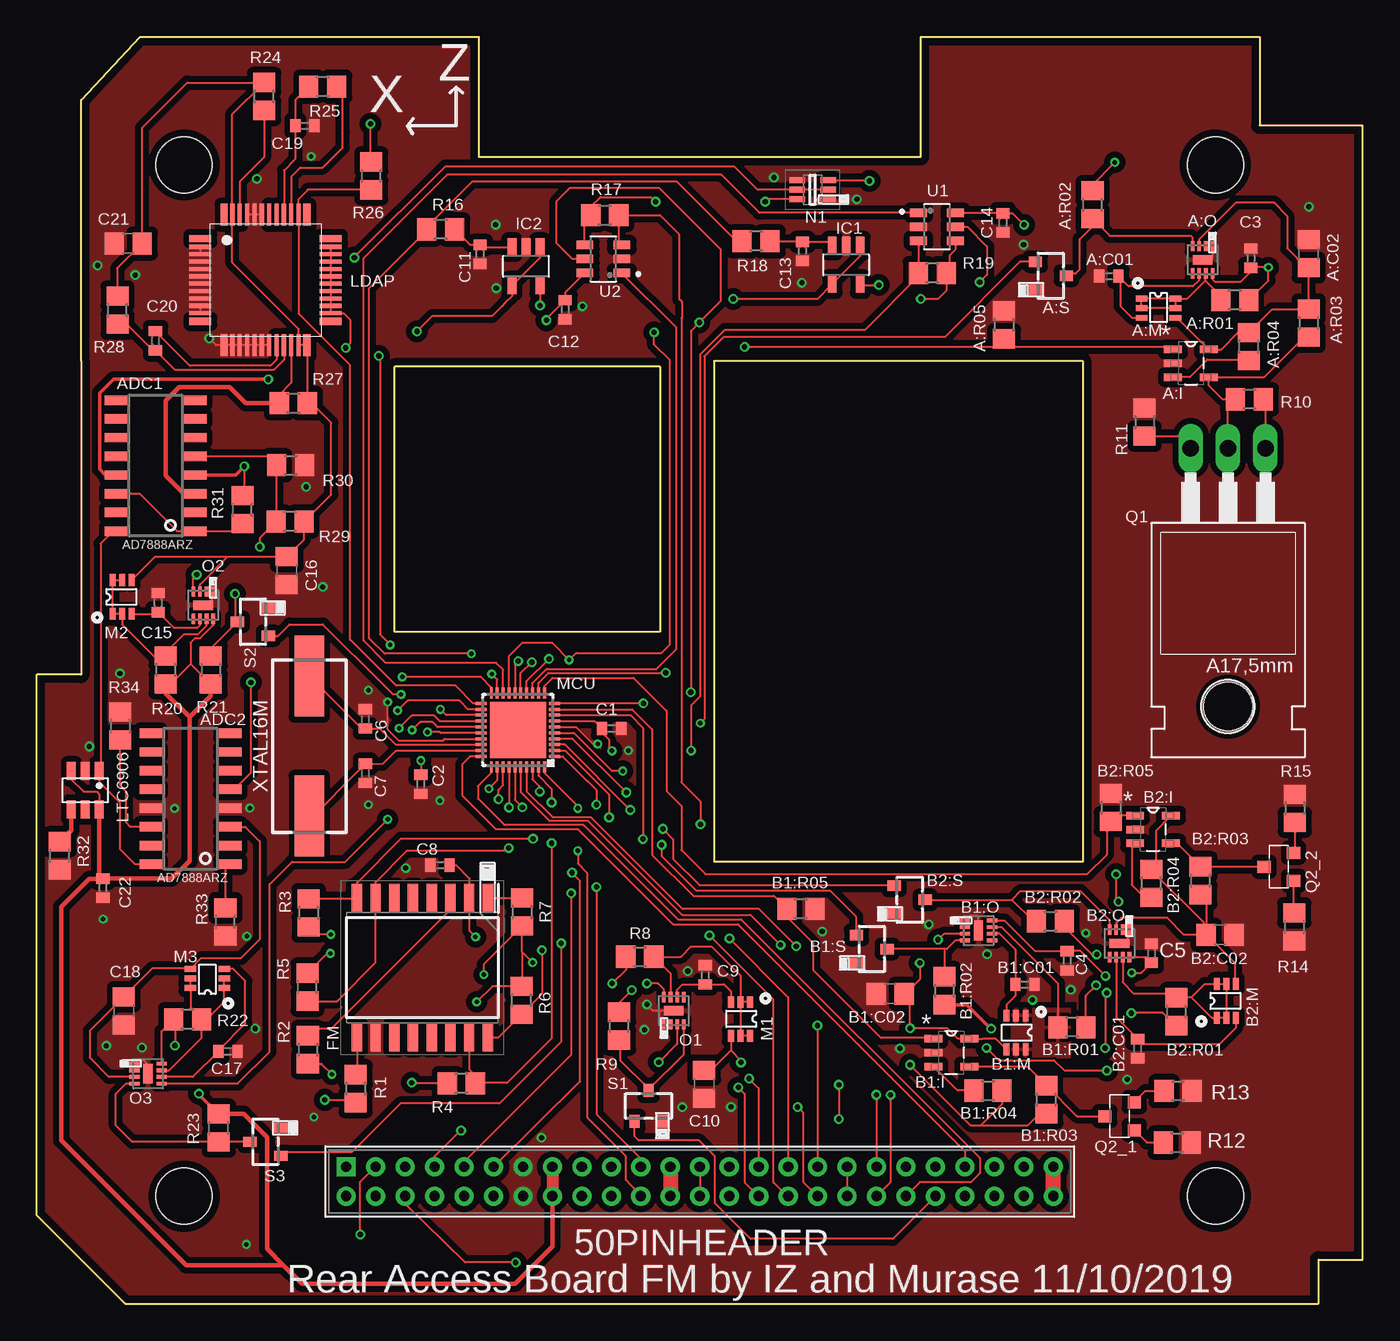
[diagram p6: board, top side]
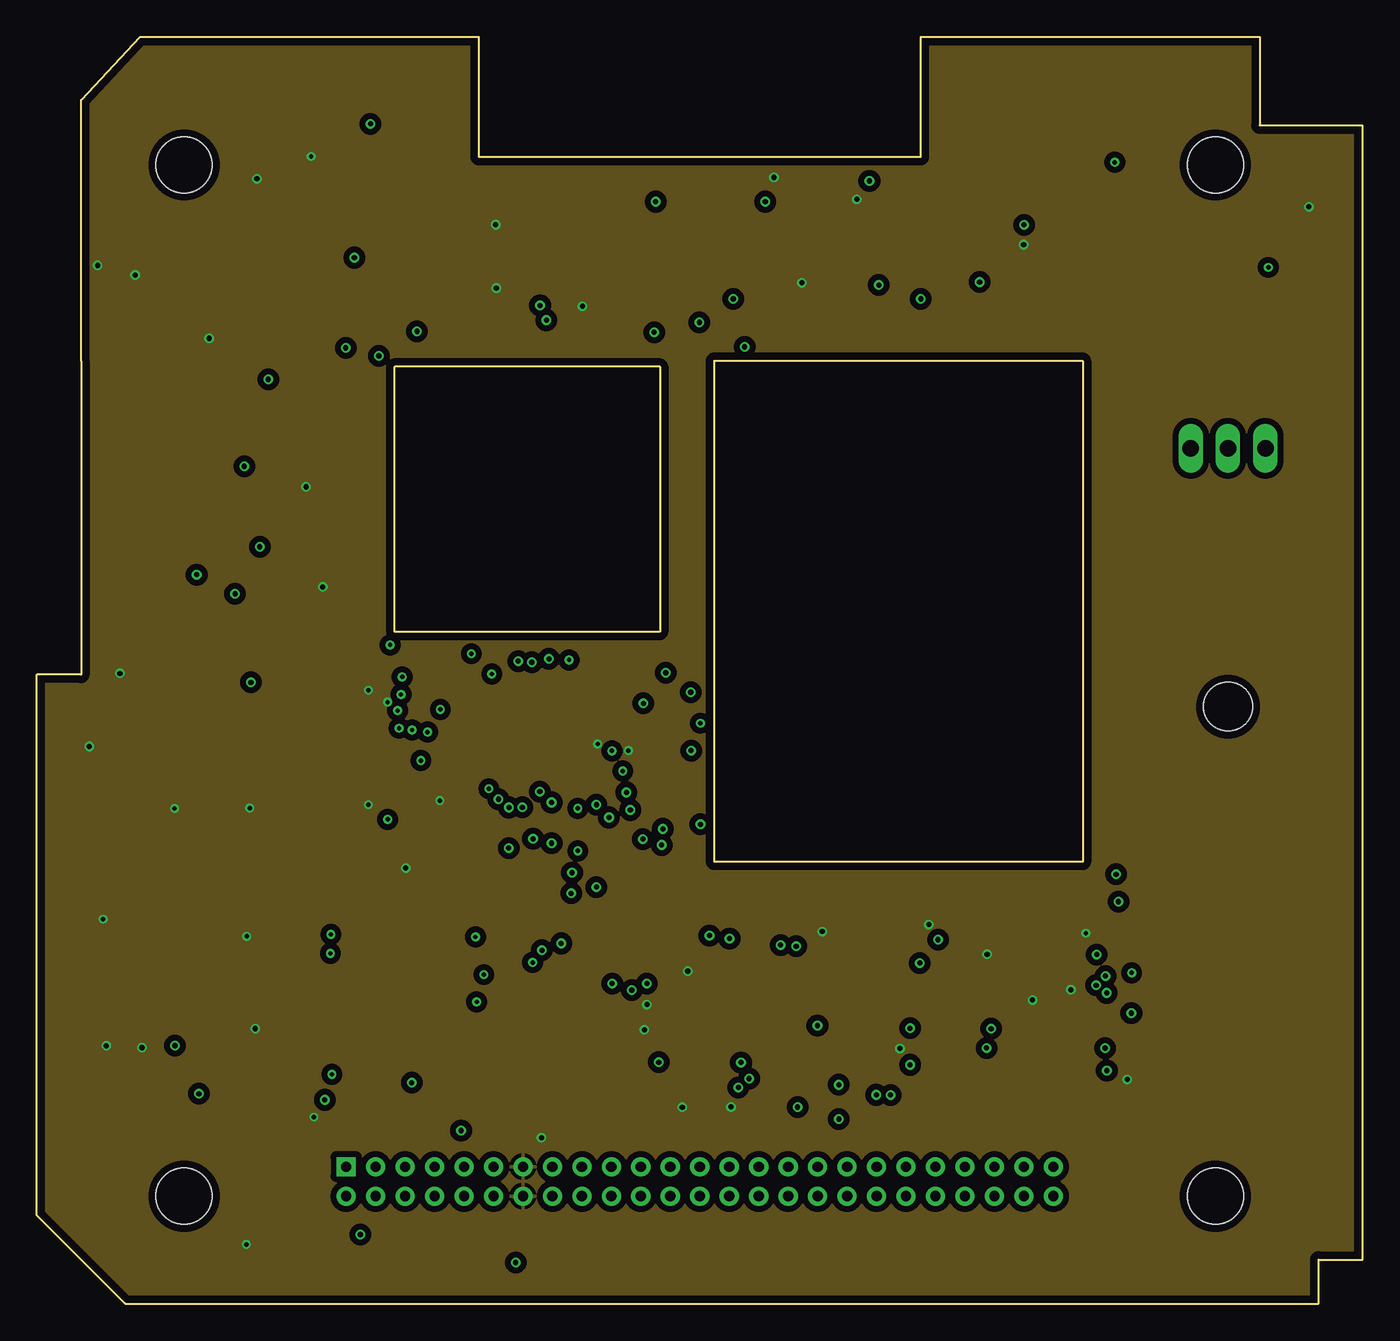
[diagram p7: board, inner layer GND]
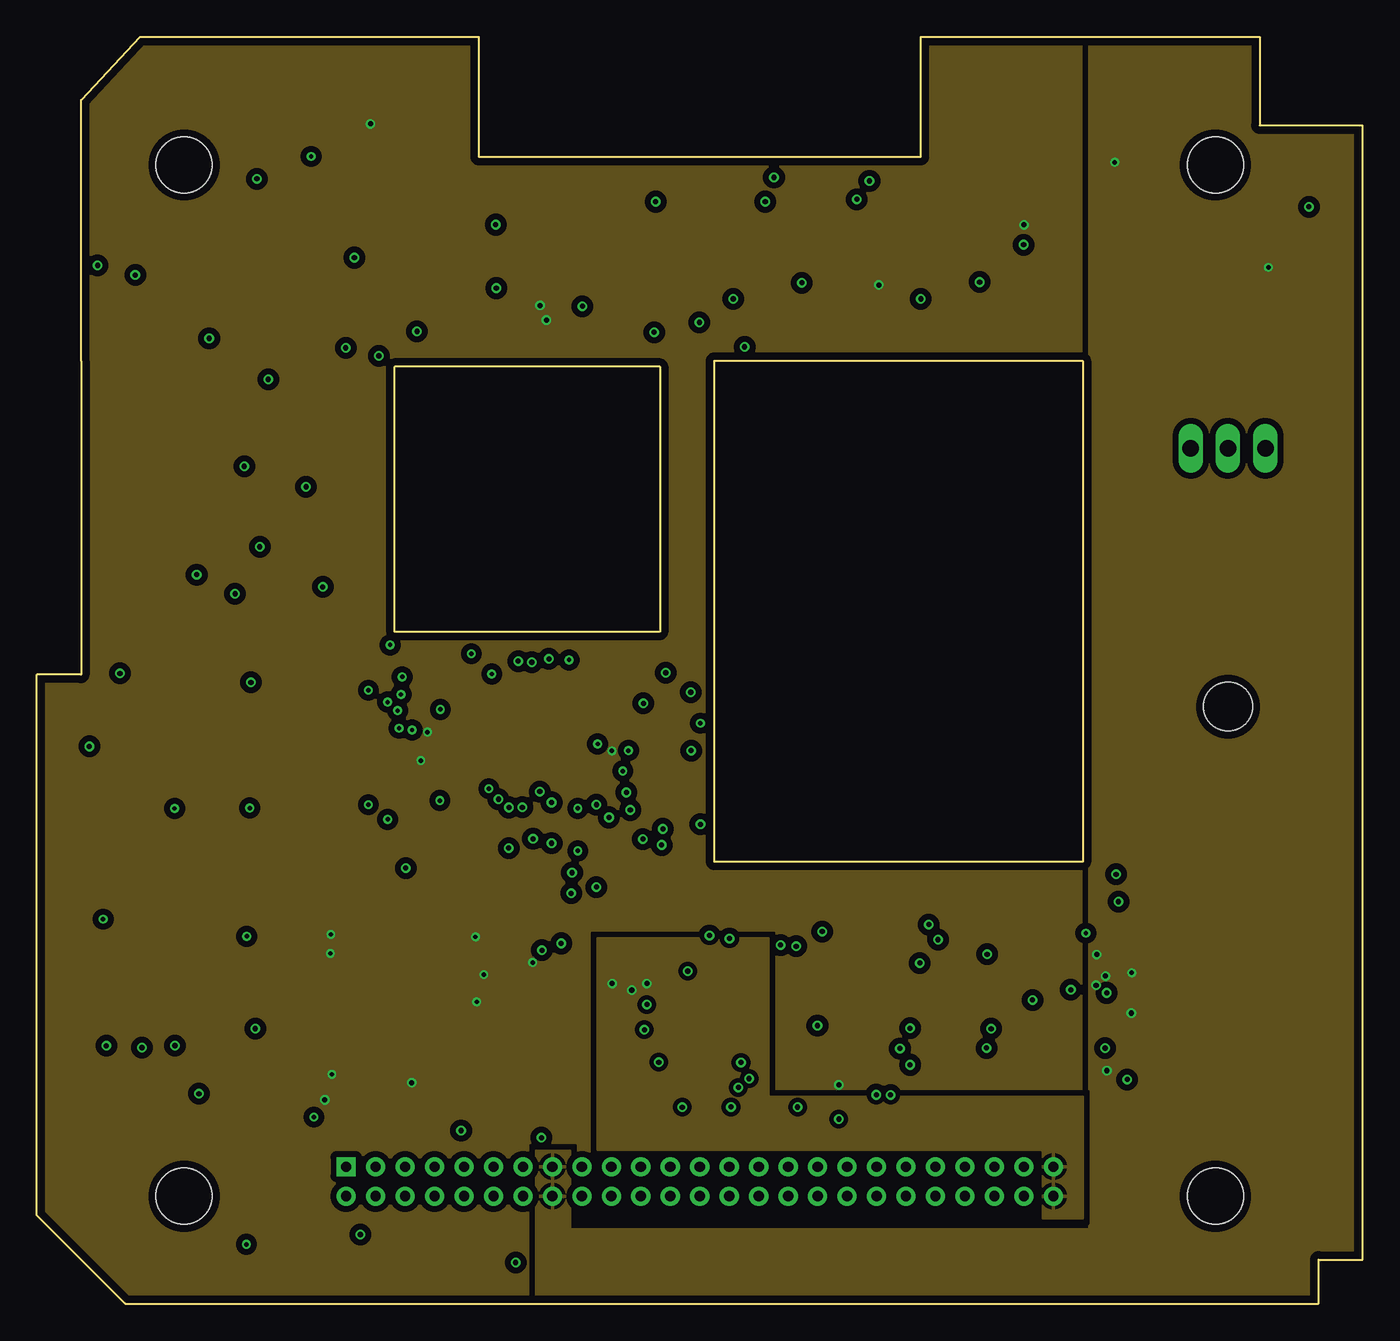
[diagram p8: board, inner layer POWER]
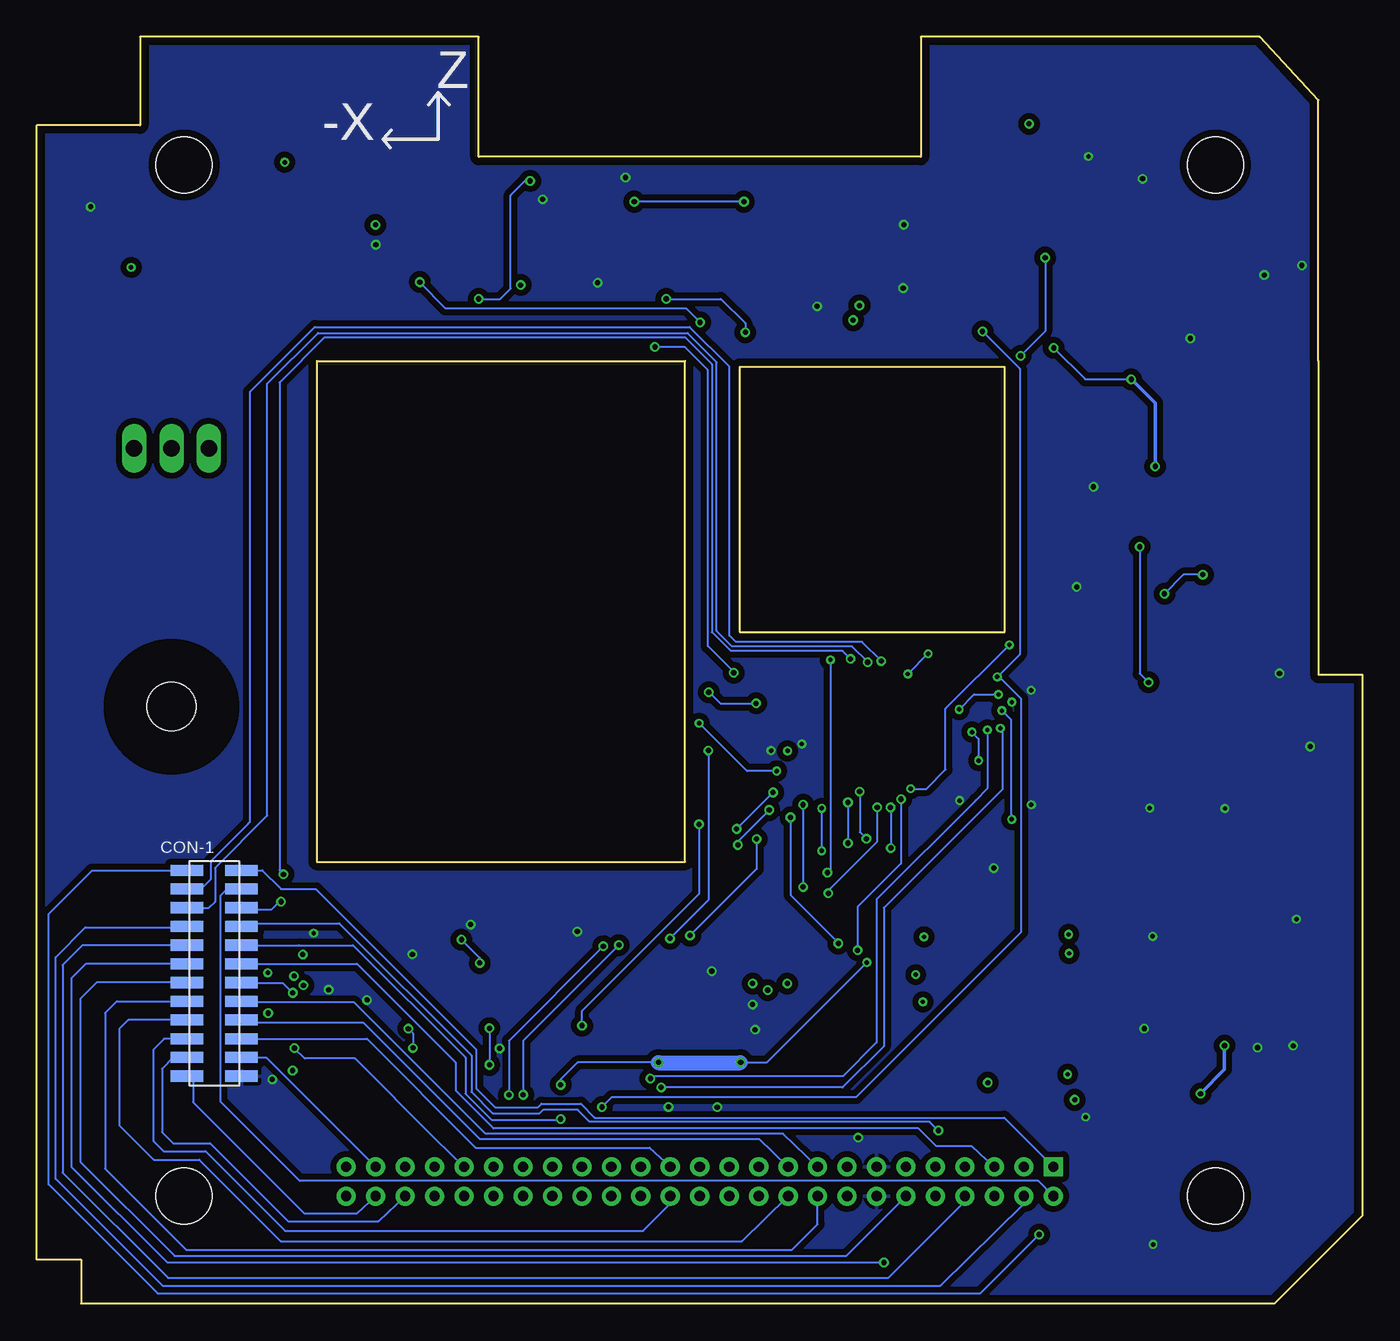
[diagram p9: board, bottom side, seen from below]

Size 90 x 86 mm. Coordinates in mm from the lower left corner, seen from the top.
Outline: 6,0 87,0 87,3 90,3 90,80 83,80 83,86 60,86 60,77.85 30,77.85 30,86 7,86 3,81.7 3,64 3,42.7 0,42.7 0,6 6,0
Outline: 42.3,63.6 24.3,63.6 24.3,45.6 42.3,45.6 42.3,63.6
Outline: 71,64 46,64 46,30 71,30 71,64
Copper layers (1+2*15+16): Top 0.018mm / dielectric 0.25mm / GND 0.035mm / dielectric 1mm / POWER 0.035mm / dielectric 0.25mm / Bottom 0.018mm
Design rules "pban_5mil-l4 *": minimum track width 5mil, minimum drill 0.3mm, track to track 5mil, track to pad 0.229mm, pad to pad 5mil, via to via 5mil, smd to smd 5mil, copper to edge 0.5mm, drill to drill 0.5mm, minimum pad ring 0.15mm, minimum via ring 0.15mm, stop-mask expansion 4mil, vias tented up to drill 0mil, thermal gap 10mil
Holes 3.8 mm at 10,7.3 80,7.3 10,77.3 80,77.3

### Footprints (pad centres in the part's own frame; a part is rotated, then mirrored left to right if it is on the bottom)
A3B-50PA-2DS(71) = drill 0.7 pad 1.3 square: 1 0,2 | drill 0.7 pad 1.3: 2 0,0; 3 2,2; 4 2,0; 5 4,2; 6 4,0; 7 6,2; 8 6,0; 9 8,2; 10 8,0; 11 10,2; 12 10,0; 13 12,2; 14 12,0; 15 14,2; 16 14,0; 17 16,2; 18 16,0; 19 18,2; 20 18,0; 21 20,2; 22 20,0; 23 22,2; 24 22,0; 25 24,2; 26 24,0; 27 26,2; 28 26,0; 29 28,2; 30 28,0; 31 30,2; 32 30,0; 33 32,2; 34 32,0; 35 34,2; 36 34,0; 37 36,2; 38 36,0; 39 38,2; 40 38,0; 41 40,2; 42 40,0; 43 42,2; 44 42,0; 45 44,2; 46 44,0; 47 46,2; 48 46,0; 49 48,2; 50 48,0
C0402 = smd 0.7 x 0.9: 1 -0.65,0; 2 0.65,0
C0805 = smd 1.3 x 1.5: 1 -0.95,0; 2 0.95,0
SOT95P280X100-5N = smd 1.219 x 0.508: 1 -1.219,0.94; 2 -1.219,0; 3 -1.219,-0.94; 4 1.219,-0.94; 5 1.219,0.94
SSM6K411TU = smd 0.4 x 0.8: 1 0,0; 2 0.65,0; 3 1.3,0; 4 1.3,2.3; 5 0.65,2.3; 6 0,2.3
DFN = smd 0.25 x 0.7: 1 -0.675,-0.925; 2 -0.225,-0.925; 3 0.225,-0.925; 4 0.675,-0.925; 5 0.675,0.925; 6 0.225,0.925; 7 -0.225,0.925; 8 -0.675,0.925 | smd 1.346 x 0.63: 9 0,0
R0805 = smd 1.3 x 1.5: 1 -0.95,0; 2 0.95,0
SOT346-R = smd 0.7 x 0.9: 1 0.95,-1.05; 2 -0.95,-1.05; 3 0,1.05
AD7888ARZ = smd 0.635 x 1.524: 1:CS -4.445,-2.695; 2:REF_IN/OUT -3.175,-2.695; 3:VDD -1.905,-2.695; 4:AGND -0.635,-2.695; 5:AIN1 0.635,-2.695; 6:AIN2 1.905,-2.695; 7:AIN3 3.175,-2.695; 8:AIN4 4.445,-2.695; 9:AIN5 4.445,2.695; 10:AIN6 3.175,2.695; 11:AIN7 1.905,2.695; 12:AIN8 0.635,2.695; 13:AGND -0.635,2.695; 14:DIN -1.905,2.695; 15:DOUT -3.175,2.695; 16:SCLK -4.445,2.695
LTC6906 = smd 0.62 x 1.22: DIV 1.9,0; GND 0.95,0; GRD 0.95,2.62; OUT 0,0; SET 1.9,2.62; V+ 0,2.62
RAB_ACCESS = smd 2.2 x 0.76: P$1 -0.15,-0.635; P$2 3.55,-0.635; P$3 -0.15,-1.905; P$4 3.55,-1.905; P$5 -0.15,-3.175; P$6 3.55,-3.175; P$7 -0.15,-4.445; P$8 3.55,-4.445; P$9 -0.15,-5.715; P$10 3.55,-5.715; P$11 -0.15,-6.985; P$12 3.55,-6.985; P$13 -0.15,-8.255; P$14 3.55,-8.255; P$15 -0.15,-9.525; P$16 3.55,-9.525; P$17 -0.15,-10.795; P$18 3.55,-10.795; P$19 -0.15,-12.065; P$20 3.55,-12.065; P$21 -0.15,-13.335; P$22 3.55,-13.335; P$23 -0.15,-14.605; P$24 3.55,-14.605
SOIC127P1032X265-16N = smd 1.925 x 0.7: 1 -4.712,4.445; 2 -4.712,3.175; 3 -4.712,1.905; 4 -4.712,0.635; 5 -4.712,-0.635; 6 -4.712,-1.905; 7 -4.712,-3.175; 8 -4.712,-4.445; 9 4.712,-4.445; 10 4.712,-3.175; 11 4.712,-1.905; 12 4.712,-0.635; 13 4.712,0.635; 14 4.712,1.905; 15 4.712,3.175; 16 4.712,4.445
SOT23-5 = smd 0.6 x 1.2: 1 -0.95,-1.306; 2 0,-1.306; 3 0.95,-1.306; 4 0.95,1.306; 5 -0.95,1.306
LQFP-48 = smd 0.5 x 1.5: 1:NC 0,0; 12:NC 5.62,0; 25:NC 5.62,8.85; 36:NC 0,8.85 | smd 0.28 x 1.5: 2:VSSBOT 0.56,0; 3:VSSBOT 1.06,0; 4:VSSBOT 1.56,0; 5:VSSBOT 2.06,0; 6:VSSBOT 2.56,0; 7:VSSBOT 3.06,0; 8:VSSBOT 3.56,0; 9:VSSBOT 4.06,0; 10:VSSBOT 4.56,0; 11:VSSBOT 5.06,0; 26:VSSCHIP 5.06,8.85; 27:VSSCHIP 4.56,8.85; 28:VSSCHIP 4.06,8.85; 29:VSSCHIP 3.56,8.85; 30:VSSCHIP 3.06,8.85; 31:VSSCHIP 2.56,8.85; 32:VSSCHIP 2.06,8.85; 33:VSSCHIP 1.56,8.85; 34:VSSCHIP 1.06,8.85; 35:VSSCHIP 0.56,8.85 | smd 1.5 x 0.5: 13:RTRIM0 7.235,1.615; 24:VDDTOP 7.235,7.235; 37:NC -1.615,7.235; 48:NC -1.615,1.615 | smd 1.5 x 0.28: 14:RTRIM1 7.235,2.175; 15:RTRIM2 7.235,2.675; 16:RTRIM3 7.235,3.175; 17:RTRIM1 7.235,3.675; 18:RTRIM2 7.235,4.175; 19:RTRIM3 7.235,4.675; 20:EXTCD 7.235,5.175; 21:EXTRD 7.235,5.675; 22:VDDCHIP 7.235,6.175; 23:VDDLDAP 7.235,6.675; 38:PG -1.615,6.675; 39:SMODECTL -1.615,6.175; 40:_SMODEEN -1.615,5.675; 41:_SMODE -1.615,5.175; 42:_LMODE -1.615,4.675; 43:VSSBOT -1.615,4.175; 44:EXTLN -1.615,3.675; 45:EXTLNEN -1.615,3.175; 46:VREF -1.615,2.675; 47:VDDLDAP -1.615,2.175
UQFN40ML5X5MM = smd 0.75 x 0.2: 1 -2.5,1.8; 2 -2.5,1.4; 3 -2.5,1; 4 -2.5,0.6; 5 -2.5,0.2; 6 -2.5,-0.2; 7 -2.5,-0.6; 8 -2.5,-1; 9 -2.5,-1.4; 10 -2.5,-1.8; 21 2.5,-1.8; 22 2.5,-1.4; 23 2.5,-1; 24 2.5,-0.6; 25 2.5,-0.2; 26 2.5,0.2; 27 2.5,0.6; 28 2.5,1; 29 2.5,1.4; 30 2.5,1.8 | smd 0.2 x 0.75: 11 -1.8,-2.5; 12 -1.4,-2.5; 13 -1,-2.5; 14 -0.6,-2.5; 15 -0.2,-2.5; 16 0.2,-2.5; 17 0.6,-2.5; 18 1,-2.5; 19 1.4,-2.5; 20 1.8,-2.5; 31 1.8,2.5; 32 1.4,2.5; 33 1,2.5; 34 0.6,2.5; 35 0.2,2.5; 36 -0.2,2.5; 37 -0.6,2.5; 38 -1,2.5; 39 -1.4,2.5; 40 -1.8,2.5 | smd 3.8 x 3.8: TH 0,0
SOT65P210X110-6N = smd 1.05 x 0.4: 1 -1.05,0.65; 2 -1.05,0; 3 -1.05,-0.65; 4 1.05,-0.65; 5 1.05,0; 6 1.05,0.65
TO220 = drill 1.118 long: 1 -2.54,-6.35; 2 0,-6.35; 3 2.54,-6.35 | hole 3.302: 0,11.176
MICRO3 = smd 0.8 x 0.9: 1 -0.95,-1; 2 0.95,-1; 3 0,1
SOT95P280X145-6N = smd 1.21 x 0.58: 1 -1.255,0.95; 2 -1.255,0; 3 -1.255,-0.95; 4 1.255,-0.95; 5 1.255,0; 6 1.255,0.95
FOXSDLF-160-20 = smd 5.5 x 2: 1 -4.75,0; 2 4.75,0

### Placement (x,y rotation side)
50PINHEADER  21,7.3 0 top
A:C01  0.1uF  [C0402]  72.76,69.75 180 top
A:C02  10uF  [C0805]  86.33,71.28 90 top
A:I  LT6106HS5PBF  [SOT95P280X100-5N]  78.34,63.84 0 top
A:M  SSM6K411TU  [SSM6K411TU]  74.99,68.22 270 top
A:O  LTC4361-2  [DFN]  79.13,70.86 180 top
A:R01  0.05Ω  [R0805]  81.32,68.12 180 top
A:R02  10kΩ  [R0805]  71.67,74.6 90 top
A:R03  10Ω  [R0805]  86.33,66.57 270 top
A:R04  100Ω  [R0805]  82.27,64.97 90 top
A:R05  1kΩ  [R0805]  65.65,66.45 270 top
A:S  DTC144EKA  [SOT346-R]  68.83,69.78 270 top
ADC1  8.07,56.89 90 top
ADC2  10.44,34.28 90 top
B1:C01  0.1uF  [C0402]  67.07,21.67 0 top
B1:C02  10uF  [C0805]  57.93,21.04 180 top
B1:I  LT6106HS5PBF  [SOT95P280X100-5N]  62.08,17.05 0 top
B1:M  SSM6K411TU  [SSM6K411TU]  67.12,19.56 180 top
B1:O  LTC4361-2  [DFN]  63.92,25.34 270 top
B1:R01  0.05Ω  [R0805]  70.27,18.77 180 top
B1:R02  10kΩ  [R0805]  61.6,21.25 270 top
B1:R03  10Ω  [R0805]  68.53,13.86 90 top
B1:R04  100Ω  [R0805]  64.56,14.47 0 top
B1:R05  1kΩ  [R0805]  51.86,26.8 180 top
B1:S  DTC144EKA  [SOT346-R]  56.68,24.08 270 top
B2:C01  0.1uF  [C0402]  74.73,17.32 270 top
B2:C02  10uF  [C0805]  80.32,25.05 0 top
B2:I  LT6106HS5PBF  [SOT95P280X100-5N]  75.77,32.19 0 top
B2:M  SSM6K411TU  [SSM6K411TU]  80.09,19.41 0 top
B2:O  LTC4361-2  [DFN]  73.49,24.46 180 top
B2:R01  0.05Ω  [R0805]  77.36,19.83 90 top
B2:R02  10kΩ  [R0805]  68.8,25.97 0 top
B2:R03  10Ω  [R0805]  78.99,28.72 90 top
B2:R04  100Ω  [R0805]  75.65,28.54 90 top
B2:R05  1kΩ  [R0805]  72.9,33.68 270 top
B2:S  DTC144EKA  [SOT346-R]  59.25,27.42 270 top
C1  39.02,39.05 0 top
C2  26.07,35.26 270 top
C3  82.41,70.97 90 top
C4  69.94,23.28 270 top
C5  75.66,23.8 90 top
C6  22.3,39.7 90 top
C7  22.3,36 270 top
C8  27.37,29.77 180 top
C9  45.37,22.33 90 top
C10  45.3,14.9 270 top
C11  30.09,71.23 270 top
C12  35.86,67.48 270 top
C13  51.97,71.43 270 top
C14  65.58,73.37 270 top
C15  8.24,47.59 90 top
C16  16.97,49.76 270 top
C17  12.98,17.13 0 top
C18  5.91,19.89 270 top
C19  18.2,79.96 0 top
C20  8.06,65.37 270 top
C21  6.2,71.97 180 top
C22  4.49,28.21 270 top
CLCK  4.24,36.16 180 top
CON-1  79.65,30.05 0 bottom
FM  26.17,22.81 270 top
IC1  54.94,70.53 180 top
IC2  33.2,70.42 180 top
LDAP  11.1,72.3 270 top
M1  48.41,20.48 180 top
M2  5.14,46.83 0 top
M3  12.73,21.43 90 top
MCU  32.65,38.95 180 top
N1  52.66,75.62 180 top
O1  43.24,19.89 0 top
O2  11.3,47.42 180 top
O3  7.55,15.62 270 top
Q1  80.86,51.71 180 top
Q2_1  73.5,12.73 90 top
Q2_2  84.3,29.66 90 top
R1  21.64,14.6 270 top
R2  18.4,17.25 270 top
R3  18.45,26.53 270 top
R4  28.82,14.96 180 top
R5  18.37,21.49 90 top
R6  32.9,20.6 90 top
R7  32.94,26.6 270 top
R8  40.93,23.56 0 top
R9  39.53,18.84 90 top
R10  82.31,61.39 180 top
R11  75.19,59.85 270 top
R12  77.42,10.94 0 top
R13  77.47,14.44 180 top
R14  85.36,25.58 270 top
R15  85.39,33.63 270 top
R16  27.41,72.92 180 top
R17  38.55,73.9 0 top
R18  48.82,72.12 180 top
R19  60.79,69.96 180 top
R20  8.75,43.03 270 top
R21  11.81,43.02 270 top
R22  10.23,19.3 180 top
R23  12.35,11.93 90 top
R24  15.43,81.95 90 top
R25  19.41,82.62 180 top
R26  22.7,76.56 90 top
R27  17.42,61.14 0 top
R28  5.48,67.45 90 top
R29  17.19,53.1 180 top
R30  17.24,56.92 0 top
R31  13.96,53.9 90 top
R32  1.56,30.41 90 top
R33  12.8,25.92 90 top
R34  5.66,39.22 270 top
S1  41.52,13.43 0 top
S2  14.67,46.29 90 top
S3  15.52,10.99 90 top
U1  61.1,73.1 0 top
U2  38.45,70.92 180 top
XTAL16M  18.5,37.85 270 top

### Tracks (layer width: path | path; a pad name or v marks a point on that pad's centre or on a via)
A:N$2
  Top 0.152: A:I.3 78.25,62.9 79.44,64.09 82.2,64.09 A:R04.1
A:N$3
  Top 0.152: A:M.3 74.37,66.92 73.56,67.73 73.56,69.61 A:C01.1 74.1,69.06 78.49,69.06 78.89,69.46 78.89,69.92 A:O.6
A:OCP_VCC
  Top 0.152: A:O.3 78.92,71.81 78.92,72.26 81.42,74.76 83.95,74.76 84.87,73.84 84.87,71.64 86.18,70.33 A:C02.1 A:R03.1 | 86.31,67.5 83.85,67.5 A:R04.2 81.54,65.92 80.4,64.78 A:I.5 77.42,66.92 A:M.4
  Top 0.254: 86.31,67.5 A:R03.1
A:ON4
  Top 0.152: A:O.4 78.45,72.36 78.33,72.49 72.83,72.49 A:R02.1 71.67,73.15 70.8,72.28 70.8,70.22 70.5,69.92 70.02,69.92 A:S.3
A:SENSE4
  Top 0.152: A:M.6 A:M.5 A:M.2 A:M.1 A:M.6 | 79.33,69.46 79.33,69.92 A:O.7 | A:M.6 78.1,68.22 79.33,69.46 | 79.33,69.46 80.37,68.42 A:R01.2
ADCS_ARM_UART_TX_TO_TMCR
  Top 0.127: 50PINHEADER.43 63,10.36 47.61,25.75 43.2,25.75 36.75,32.2 31.17,32.2 28.89,34.48 28.89,36.64 29.4,37.15 MCU.30
ADCS_PROG_PIN1
  Bottom 0.152: 50PINHEADER.4 23,6.79 28.66,1.22 81.47,1.22 88.73,8.48 88.73,23.52 86.7,25.55 79.71,25.55 CON-1.P$7
ADCS_PROG_PIN2  (via drill 0.35)
  Top 0.127: 50PINHEADER.7 27,10.01 28.74,11.75 v28.8,11.75
  Bottom 0.152: CON-1.P$8 75.73,25.83 69.48,25.83 60.5,16.85 60.5,14.38 59.05,12.93 55.86,12.93 55.62,13.17 53.29,13.17 52.47,12.35 29.4,12.35 v28.8,11.75
ADCS_PROG_PIN3
  Bottom 0.152: CON-1.P$9 86.91,24.34 88.25,23 88.25,8.9 81.1,1.75 32.2,1.75 27,6.95 50PINHEADER.8
APRS_PROG_RX
  Bottom 0.152: CON-1.P$19 81.36,17.99 82.1,17.25 82.1,11.05 81.4,10.35 78.55,10.35 73.15,4.95 48.85,4.95 47.1,6.7 50PINHEADER.28
APRS_PROG_TX
  Bottom 0.152: CON-1.P$20 67.59,17.99 60.2,10.6 48.4,10.6 50PINHEADER.27
B1:N$2
  Top 0.152: B1:R04.1 62.5,14.47 B1:I.3
B1:N$3
  Top 0.152: B1:M.3 65.82,20.3 66.42,20.9 B1:C01.1 66.42,24.04 65.33,25.13 64.86,25.13 B1:O.6
B1:OCP_VCC  (via drill 0.35)
  Top 0.127: 59.94,22.02 58.96,21.04 B1:C02.1
  Top 0.152: B1:O.3 61.58,25.11 v61.17,24.71 | v59.94,23.13 59.94,22.02 | B1:M.4 65.09,17.99 64.19,17.99 | 64.19,17.99 | 64.19,17.99 B1:I.5 62.52,17.99 61.81,18.7 v59.27,18.7 59.27,20.66 B1:C02.1 | B1:R03.1 68.09,12.91 67.29,12.11 64.07,12.11 | v59.28,16.22 63.38,12.11 64.07,12.11 | B1:R04.2 65.51,13.55 64.07,12.11
  Bottom 0.152: v61.17,24.71 59.94,23.48 v59.94,23.13 | v59.27,18.7 v59.27,16.22 v59.28,16.22
B1:ON4
  Top 0.152: B1:O.4 62.37,24.66 61.78,24.08 61.6,24.08 | 61.6,24.08 B1:S.3 | 61.6,24.08 B1:R02.1
B1:SENSE4
  Top 0.152: B1:O.7 65.49,25.57 69.32,21.73 B1:R01.2
  pour Top: 66.16,20.01 66.16,16.73 70.16,16.73 70.16,20.01
B2:N$2
  Top 0.152: B2:R04.1 75.17,27.59 74.32,28.44 74.32,31.02 B2:I.3
B2:N$3
  Top 0.152: B2:M.3 81.39,18.73 80.31,17.65 75.05,17.65 B2:C01.1 73.27,19.43 B2:O.6
B2:OCP_VCC
  Top 0.152: B2:M.4 81.36,21.74 81.36,23.09 79.39,25.06 79.39,25.07 | 79.39,25.07 79.39,27.37 B2:R03.1 | B2:C02.1 79.39,25.07 | B2:I.5 75.96,32.1 75.96,29.8 B2:R04.2 75.65,29.43 79.2,25.88 79.2,25.22 B2:C02.1 | B2:C02.1 77.87,25.05 76.73,26.19 73.6,26.19 73.27,25.85 B2:O.3
B2:ON4
  Top 0.15: 66.19,27.42 67.64,25.97 B2:R02.1
  Top 0.152: B2:S.3 66.19,27.42 66.78,28.01 70.85,28.01 72.81,26.05 B2:O.4
B2:SENSE4
  Top 0.152: 78.38,20.8 79.28,21.71 B2:M.6 B2:M.5 B2:M.2 B2:M.1 79.77,19.41 78.38,20.8 | B2:O.7 73.72,21.82 74.48,21.05 77.37,21.05 B2:R01.2 77.39,20.8 78.38,20.8
BCTEMP_IN  (via drill 0.35)
  Top 0.127: MCU.35 32.45,34.21 v32.96,33.7
  Top 0.152: 50PINHEADER.9 29,9.61 29.01,9.64 36.27,16.9 v36.27,27.86
  Bottom 0.152: v32.96,33.7 32.96,31.35 36.27,28.04 v36.27,27.86
CAM_DTR
  Bottom 0.152: CON-1.P$23 79.39,15.19 79.39,13.68 71.86,6.14 68.25,6.14 50PINHEADER.48
CAM_UART_RX0
  Bottom 0.152: CON-1.P$22 74.42,16.72 50PINHEADER.47
CAM_UART_TX0
  Bottom 0.152: CON-1.P$21 80.73,16.72 81.5,15.95 81.5,11.65 80.75,10.9 78.25,10.9 72.95,5.6 66.8,5.6 50PINHEADER.46
CLK
  Top 0.152: ADC2.16:SCLK 6.67,29.84 5.63,30.88 5.63,34.02 4.24,35.42 CLCK.OUT 4.32,36.24 4.32,51.59 5.17,52.45 ADC1.16:SCLK
DAC_VREF  (via drill 0.35)
  Top 0.127: v41.18,40.75 MCU.10
  Top 0.15: U2.5 36.36,70.92 35.29,71.99 35.29,74.84 36.2,75.75 42.24,75.75 46.42,71.57 46.42,68.06 v44.98,66.62
  Top 0.152: U1.5 63.16,73.1 64.5,71.76 64.5,69.85 v64,69.35 | v44.98,66.62 44.39,66.03 v44.39,41.51
  Bottom 0.152: v44.39,41.51 44.37,41.51 43.61,40.75 v41.18,40.75 | v64,69.35 64,69.3 62.28,67.58 45.94,67.58 v44.98,66.62
GND  (via drill 0.3, 0.3 pad 0.1, 0.35)
  Top 0.127: MCU.6 36.59,39.15 37.74,38 v38.07,38 | MCU.27 27.69,38.34 27.56,38.21 24.59,38.21 23.81,38.99 v23.81,40.84 | O2.9 11.48,47.41 11.97,47.91 O2.1 | O1.9 42.26,19.89 | 42.26,19.89 42.17,19.89 | O1.1 42.26,19.27 42.26,19.89 | LDAP.10:VSSBOT LDAP.11:VSSBOT | O3.9 7.55,16.23 7.22,16.56 6.89,16.56 O3.1 | B1:O.9 63.92,26.23 63.82,26.33 63.31,26.33 B1:O.1
  Top 0.152: LDAP.45:EXTLNEN LDAP.43:VSSBOT LDAP.44:EXTLN | LDAP.19:RTRIM3 LDAP.13:RTRIM0 12.16,65.06 v11.7,65.53 | LDAP.2:VSSBOT LDAP.3:VSSBOT | 42.17,19.89 41.83,19.89 v41.41,20.31 | 73.68,24.46 73.7,24.46 74.17,24.93 B2:O.1 | 73.68,24.46 | 73.68,24.46 B2:O.9 | A:O.1 79.81,70.98 79.65,70.83 79.62,70.86 A:O.9
  other vias: 34.25,11.27 31.15,73.25 31.19,68.94 50.04,76.46 25.04,29.58 4.72,17.51 7.14,17.39 14.83,18.67 5.64,42.79 3.56,37.83 18.27,55.45 4.13,70.48 6.68,69.83 14.94,76.36 22.51,41.65 22.5,33.87 40.16,37.55 27.36,34.16 44.19,22.58 41.24,18.6 47.12,13.36 43.81,13.34 53.31,25.27 58.59,17.33 64.51,23.72 60.55,25.74 71.21,25.16 51.93,69.31 37.04,67.71 66.99,71.89 67.59,20.62 74.02,15.22 86.35,74.46 9.35,33.62 18.81,12.67 14.23,4.03 4.5,26.11 14.25,24.94 18.62,77.88 14.45,33.65 19.41,48.66 55.66,74.97 70.19,21.31
  pour Top (isolate 0.406, rank 4, no thermals): 6.8,86.5 91.8,86.5 91.8,-1 -1.4,-1 -1.4,80.1 3.7,85.2 5,86.5
  pour GND (isolate 0.406): 6,86.5 91,86.5 91,-1 -2.2,-1 -2.2,80.1 2.9,85.2 4.2,86.5
  pour Bottom (isolate 0.406): 5.7,86.5 92.5,86.5 92.5,-1 -0.7,-1 -0.7,80.1
HALF_VDD  (via drill 0.35)
  Top 0.152: ADC1.5:AIN1 15.69,57.52 R30.1 16.24,56.92 R29.2 15.13,51.99 v15.13,51.38 | ADC2.5:AIN1 13.4,34.91 14.53,36.04 v14.53,42.18
  Bottom 0.152: v15.13,51.38 15.13,42.78 v14.53,42.18
HNT_PROG_D+
  Bottom 0.152: CON-1.P$16 75.87,20.45 68.45,20.45 59.55,11.55 39.35,11.55 50PINHEADER.17
HNT_PROG_D-
  Bottom 0.152: CON-1.P$15 84.57,20.53 85.37,19.73 85.37,9.17 79.85,3.65 38.75,3.65 37,5.4 50PINHEADER.18
HNT_PROG_DIO
  Bottom 0.152: CON-1.P$17 83.79,19.26 84.4,18.65 84.4,12.12 82.06,9.78 78.97,9.78 73.45,4.25 42.15,4.25 50PINHEADER.20
HNT_PROG_VBUS
  Bottom 0.152: CON-1.P$18 75.79,19.1 67.85,19.1 59.93,11.18 40.98,11.18 39.03,9.33 50PINHEADER.19
HOLD#
  Top 0.152: R7.1 32.91,27.52 FM.1
I1-  (via drill 0.35)
  Top 0.152: U2.4 37.2,73.5 R17.1 37.6,74.47 38.25,75.12 41.69,75.12 v42,74.81 | N1.6 49.6,74.97 v49.44,74.81
  Bottom 0.152: v42,74.81 v49.44,74.81
I2-  (via drill 0.35)
  Top 0.152: U1.4 62.35,71.56 61.95,71.15 61.95,69.96 R19.1 61.74,68.77 61.18,68.21 v60.01,68.21 | v56.52,76.22 53.76,76.22 N1.3
  Bottom 0.152: v60.01,68.21 58.55,68.21 57.84,68.92 57.84,75.24 56.86,76.22 v56.52,76.22
ICSPCLK_MISSION_BOSS  (via drill 0.35)
  Top 0.127: MCU.14 33.25,42.26 v34.76,43.77
  Top 0.152: v73.26,29.15 v73.25,29.14 73.25,27.46 v73.42,27.29
  Bottom 0.152: CON-1.P$6 75.85,26.78 74.06,26.78 73.55,27.29 v73.42,27.29 | v73.26,29.15 73.53,29.42 73.53,62.54 70.47,65.6 45.99,65.6 44.17,63.78 44.17,45.59 42.89,44.31 35.3,44.31 v34.76,43.77
ICSPCLK_SFWARD  (via drill 0.35)
  Top 0.152: 50PINHEADER.3 21.96,8.26 v21.96,4.7
  Bottom 0.152: CON-1.P$1 79.67,29.4 86.25,29.4 89.2,26.45 89.2,8.1 81.8,0.7 25.96,0.7 v21.96,4.7
ICSPDAT_MISSION_BOSS  (via drill 0.35)
  Top 0.127: MCU.15 32.85,42.8 v33.6,43.55
  Bottom 0.152: CON-1.P$5 78.32,26.88 77.91,27.29 77.91,29.57 74.35,33.13 74.35,62.46 70.92,65.89 45.83,65.89 43.85,63.91 43.85,45.67 42.8,44.62 34.67,44.62 v33.6,43.55
ICSPDAT_SFWARD
  Bottom 0.152: CON-1.P$4 77.07,28.15 77.55,27.67 77.55,13.73 72.15,8.33 22.03,8.33 50PINHEADER.2
ICU-CLK
  Bottom 0.152: CON-1.P$13 85.95,21.8 87.05,20.7 87.05,9.65 80.65,3.25 35.05,3.25 50PINHEADER.12
ICU_PROG_DIO  (via drill 0.35)
  Top 0.152: v72.63,21.1 72.52,20.99 v72.52,17.35
  Bottom 0.152: 50PINHEADER.41 62.97,11.21 68.4,16.64 71.81,16.64 v72.52,17.35 | v72.63,21.1 73.3,21.77 75.92,21.77 CON-1.P$14
ICU_PROG_RST
  Bottom 0.127: 50PINHEADER.5 25.03,9.3 26.53,10.7 28.95,10.7 30.15,11.9
  Bottom 0.152: CON-1.P$12 68.26,23.07 61.57,16.38 61.57,14.47 59,11.9 30.15,11.9
ICU_PROG_VCC  (via drill 0.35)
  Top 0.152: v32.5,2.8 29.07,2.8 25,6.79 50PINHEADER.6
  Bottom 0.152: CON-1.P$11 86.68,23.07 87.65,22.1 87.65,9.3 81.15,2.8 v32.5,2.8
MAIN_PIC_DIO_TO_MISSION_BOSS
  Top 0.127: S1.2
  Top 0.152: 50PINHEADER.42 58.1,4.4 48.45,4.4 46.03,6.82 46.03,10 44.95,11.08 40.86,11.08 40.56,11.38 S1.2
MAIN_PIC_UART_RX_TO_MISSION_BOSS  (via drill 0.3 pad 0.1)
  Top 0.127: 50PINHEADER.22 39.99,8.41 39.99,10.01 37.36,12.64 37.36,29.24 36.72,29.88 v36.72,30.74 | MCU.40 34.45,36.03 36.72,33.76 v36.72,33.63
  Bottom 0.127: v36.72,33.63 v36.72,30.74
MAIN_PIC_UART_TX_TO_MISSION_BOSS  (via drill 0.35)
  Top 0.127: MCU.1 35.7,37.15 37.35,35.5 37.4,35.45 37.99,34.86 v37.99,33.88
  Top 0.152: 50PINHEADER.21 41,9.79 41.01,9.85 37.99,12.87 37.99,28.27 v37.99,28.28 v37.99,28.29
  Bottom 0.152: v37.99,33.88 v37.99,28.29
MISSION_BOSS_DIO_TO_APRS(5V)  (via drill 0.35)
  Top 0.127: MCU.37 33.25,34.78 34.99,33.04 37.6,33.04 43.85,26.79 49.02,26.79 v51.55,24.26 | 50PINHEADER.38 57.95,8.25 v57.95,14.17
  Bottom 0.127: v51.55,24.26 57.95,17.86 v57.95,14.17
MISSION_BOSS_DIO_TO_HNT(5V)
  Top 0.127: MCU.31 30.85,36.04 29.94,35.14 29.94,34.3 31.75,32.49 37.11,32.49 43.51,26.09 47.81,26.09 64,9.89 64,8.85 63.41,8.26 59.94,8.26 59.53,7.84 59.53,7.83 50PINHEADER.40
MISSION_BOSS_DIO_TO_SF-WARD(3.3V)  (via drill 0.35)
  Top 0.127: MCU.36 32.85,34.73 34.81,32.77 37.43,32.77 43.8,26.4 48.44,26.4 v50.48,24.35 | v56.99,14.18 50PINHEADER.37
  Bottom 0.127: v50.48,24.35 56.99,17.84 v56.99,14.18
MISSION_BOSS_UART_RX_TO_SF-WARD  (via drill 0.3, 0.35)
  Top 0.127: v48.35,15.28 49,14.63 50PINHEADER.29 | MCU.25 27.2,39.15 26.86,39.49 26.02,39.49 v25.48,38.95
  Bottom 0.127: v25.48,38.95 25.48,34.97 | 26.27,34.18 33,27.45 33,17.73 35.28,15.45 48.18,15.45 v48.35,15.28
  Bottom 0.15: 26.27,34.18 25.48,34.97
MISSION_BOSS_UART_TX_TO_SF-WARD  (via drill 0.3, 0.35)
  Top 0.127: v47.62,14.68 48.04,14.26 48.04,8.24 48.98,7.3 50PINHEADER.30 | v24.59,39.07 25.45,39.93 26.97,39.93 27.35,39.55 MCU.24
  Bottom 0.127: 24.45,34.92 32.5,26.87 32.5,17.48 35.3,14.68 v47.62,14.68
  Bottom 0.152: v24.59,39.07 24.45,38.93 24.45,34.92
N$1
  Top 0.152: Q2_1.2 75.26,14.44 R13.2
N$2
  Top 0.152: Q2_1.1 75.34,10.94 R12.1
N$3
  Top 0.127: R18.1 51.92,72.12 C13.1 53.74,72.08 IC1.3
N$4
  Top 0.152: R16.1 29.41,71.88 C11.1 30.24,71.73 IC2.3
N$5
  Top 0.152: ADC2.1:CS 12.8,29.5 R33.2
N$6
  Top 0.152: B2:I.4 77.41,31.25 B2:R03.2 Q2_2.3
N$7
  Top 0.305: CLCK.SET 2.34,32.14 R32.2
N$8
  Top 0.152: ADC2.14:DIN 6.36,32.38 6.05,32.68 6.05,34.79 5.66,35.18 R34.2
N$9
  Top 0.152: O3.4 6.07,14.95 5.36,14.24 5.36,12.1 6.48,10.98 R23.1 S3.3
N$10
  Top 0.152: R15.2 85.39,30.7 Q2_2.2
N$11
  Top 0.152: O3.6 10.6,15.39 C17.1 12.33,17.21 14.15,19.03 14.15,21.9 13.32,22.73 M3.3
N$12
  Top 0.152: ADC1.14:DIN 6.99,54.98 9.53,52.45 ADC1.1:CS 13.46,52.45 R31.1
N$13
  Top 0.152: Q2_2.1 85.3,26.53 R14.1
N$15
  Top 0.152: Q1.2 80.86,60.89 R10.2 80.51,61.39 79.56,62.34 A:I.4 83.31,62.9 86.03,65.62 A:R03.2
N$16
  Top 0.152: R11.2 77.48,58.9 Q1.3
N$17
  Top 0.152: R10.1 83.4,61.25 Q1.1
N$18
  Top 0.152: Q2_1.3 70.61,12.73 B1:R03.2 67.23,16.11 B1:I.4
N$19
  Top 0.152: LDAP.39:SMODECTL 17.27,76.52 17.88,77.12 19.39,77.12 20.76,78.49 20.76,79.49 20.76,82.22 R25.1
N$20
  Top 0.152: LDAP.40:_SMODEEN 16.77,76.92 17.55,77.69 C19.1 17.55,81.71 R25.2
N$21
  Top 0.152: R22.1 10.43,20.05 M3.6 M3.5 | M3.2 M3.1 12.73,20.5 11.53,19.3 R22.1 | O3.7 8.97,15.85 11.18,18.05 R22.1
N$22
  Top 0.127: M2.3 8.13,46.83 C15.1 9.33,45.85 10.87,45.85 11.04,46.02 11.04,46.46 O2.6
N$23
  Top 0.127: M2.5 M2.6 M2.1 M2.2 5.79,46.12 7.93,43.98 R20.1 8.75,44.21 9.99,45.45 10.94,45.45 11.53,46.03 O2.7
N$26
  Top 0.152: O1.6 43.47,21.32 43.79,21.64 45.14,21.64 45.37,21.87 C9.1 46.64,21.68 47.11,21.21 M1.3
N$27
  Top 0.152: R24.1 15.43,77.83 13.78,76.17 LDAP.46:VREF
N$28
  Top 0.152: C20.1 8.06,66 10.38,63.68 15.86,63.68 16.27,64.09 LDAP.20:EXTCD
N$29  (via drill 0.35)
  Top 0.127: R21.1 11.81,44.49 13.3,45.98 13.31,45.98 S2.3 13.46,46.45 v13.46,48.19 | O2.4 10.62,49.27 v10.85,49.49
  Bottom 0.127: v10.85,49.49 12.16,49.49 v13.46,48.19
N$31
  Top 0.152: LDAP.22:VDDCHIP 17.27,62.52 16.47,61.71 R27.1
  Top 0.305: ADC1.3:VDD 9.98,54.98 8.74,56.23 8.74,61.31 9.66,62.23 13.09,62.23 14.18,61.14 R27.1
N$32
  Top 0.127: C20.2 7.95,64.64 6.09,66.5 R28.1
  Top 0.152: C20.2 9.39,63.38 16.06,63.38 16.77,64.09 LDAP.21:EXTRD
NTU(LDAP)_OCP  (via drill 0.3)
  Top 0.127: S2.2 16.38,45.34 17.16,46.12 19.41,46.12 23.57,41.95 24.17,41.36 v24.72,41.36 | MCU.23 27.79,39.95 v27.39,40.35
  Bottom 0.127: v27.39,40.35 26.38,41.36 v24.72,41.36
NTU_OCP  (via drill 0.35)
  Top 0.127: MCU.2 35.85,37.55 38.84,34.56 v38.84,33.01 | v35.59,24.46 35.59,17.78 31.41,13.6 24.68,13.6 21.37,10.29 16.82,10.29 S3.2
  Bottom 0.127: v38.84,33.01 v38.83,33 38.83,27.74 35.59,24.5 v35.59,24.46
OC_MCU  (via drill 0.3 pad 0.1)
  Top 0.127: MCU.22 29.28,40.35 28.69,40.94 25.17,40.94 v24.49,40.26
  Top 0.15: 20.94,30 v23.82,32.88
  Top 0.152: O3.5 13.64,14.95 15.8,17.11 15.8,28.47 17.33,30 20.94,30
  Bottom 0.15: 23.85,39.42 23.85,32.91 v23.82,32.88
  Bottom 0.152: 23.85,39.42 23.85,39.62 v24.49,40.26
OCP_V+  (via drill 0.3 pad 0.1, 0.35)
  Top 0.127: v39.04,37.53 38.83,37.74 38.83,38.29 38.37,38.74 C1.1 | MCU.26 27.42,38.74 27.36,38.8 v26.52,38.8 | v26.07,36.87 C2.1
  Top 0.14: C8.1 28.45,29.77 29.34,28.88 FM.2 | R4.2 25.49,14.96 v25.45,15 | MCU.7 37.87,39.55 C1.1
  Top 0.152: R1.2 21.35,13.65 21.16,13.84 v19.54,13.84 | IC1.5 55.96,69.15 v57.16,69.15 | v22.65,80.1 22.65,78.01 R26.2 | IC2.5 v34.15,67.77 v34.16,67.76 | 32.94,23.88 32.94,21.59 R6.2 30.92,21.55 v29.86,20.49 | FM.2 29.34,25.34 v29.78,24.9 | v30.34,22.34 30.34,23.05 R7.2 32.94,23.88 | v19.96,25.07 18.96,25.07 R3.2 | v19.93,23.78 19.71,23.78 R5.2 | v20.03,15.57 19.3,16.3 R2.2 | v33.66,23.16 32.94,23.88 | M1.4 47.11,17.19 | v47.8,16.38 47.8,16.5 47.11,17.19 | C10.1 45.77,15.85 47.11,17.19 | O1.3 43.47,17.64 v42.22,16.39 | U2.6 35.86,68.64 C12.1 34.59,66.86 v34.59,66.77 | U1.6 65.55,74.05 C14.1 66.23,74.02 v67.01,73.24 | v54.44,14.86 v54.44,12.53
  Bottom 0.127: v26.52,38.8 26.07,38.35 v26.07,36.87
  Bottom 0.152: 42.24,16.37 v42.22,16.39 40.43,16.39 v33.66,23.16 | CON-1.P$10 72.21,24.34 68.53,24.34 60.9,16.71 60.9,14.26 59.09,12.45 54.52,12.45 v54.44,12.53 | v47.8,16.38 53.28,16.38 54.44,15.22 v54.44,14.86
  Bottom 1.016: v47.8,16.38 47.79,16.37 42.24,16.37
  pour POWER (isolate 0.406, rank 4): -3.97,84.54 -3.97,1.38 -0.01,-2.58 90.41,-2.58 91.73,-1.26 91.73,86.52 90.74,87.51 -1,87.51
OCP_VCC
  Top 0.127: M3.4 11.17,23.47
  Top 0.152: M3.4 10.41,22.75 7.82,22.75 C18.1 3.61,18.54 3.61,16.68 4.89,15.39 O3.3 | 11.17,23.47 13.86,23.47 15.13,24.74 15.13,31.39 14.14,32.38 ADC2.3:VDD
OCP_VCC(LDAP)
  Top 0.127: 12.96,50.71 11.07,48.82 O2.3
  Top 0.152: M2.4 8.02,50.71 12.96,50.71 C16.1 18.14,51.88 R29.1 19.98,54.94 19.98,59.81 18.65,61.14 R27.2 18.37,65.03 LDAP.24:VDDTOP LDAP.23:VDDLDAP 17.77,66.17 13.28,70.67 LDAP.47:VDDLDAP 13.28,80.75 R24.2 | R28.2 5.47,70.27 5.46,70.28 C21.1 7.15,79.83 10.22,82.9 R24.2 | R24.2
ON4
  Top 0.152: O1.4 43.91,16.93 41.52,14.54 S1.3 41.52,14.61 39.6,16.53 39.6,17.89 R9.1
OSC1
  Top 0.127: MCU.28 24.36,37.95 23.27,39.04 22.57,39.04 C6.1 | C6.1 | 22.05,39.05 C6.1
  Top 0.152: XTAL16M.1 22.05,39.05
OSC2
  Top 0.127: MCU.29 24.39,37.55 23.5,36.66 C7.1
  Top 0.152: C7.1 18.2,32.55 17.93,32.55 18.48,33.1 XTAL16M.2
PG_MCU
  Top 0.127: LDAP.38:PG 17.77,67.21 21.26,63.72 21.26,45.08 24.39,41.95 28.41,41.95 29.61,40.75 MCU.21
  Top 0.152: R26.1 18.38,75.61 18.38,75.6 17.77,75 LDAP.38:PG
PHOTODIODE  (via drill 0.35)
  Top 0.127: MCU.8 40.29,39.95 41.14,39.1 v41.14,31.55 v41.14,31.54
  Top 0.152: 50PINHEADER.32 50.93,7.3 50,8.23 50,20.66 v45.66,25
  Bottom 0.152: v45.66,25 41.14,29.51 v41.14,31.54
PSC1+  (via drill 0.3 pad 0.1, 0.35)
  Top 0.127: v51.64,13.35 52.01,12.98 52.01,8.29 50PINHEADER.34 | MCU.20 30.85,41.84 30.14,42.55 v24.8,42.55
  Top 0.152: v25.81,66.01 26.87,67.07 30.93,67.07 31.54,67.68 31.8,67.94 32.25,68.39 IC2.4 34.15,71.02 IC2.1
  Bottom 0.127: v51.64,13.35 50.98,14.01 | 23.19,25.21 23.19,41.07 24.67,42.55 v24.8,42.55 23.27,44.08 23.27,63.48 v25.8,66.01 v25.81,66.01
  Bottom 0.15: 23.19,25.21 34.39,14.01 50.98,14.01
PSC1-  (via drill 0.35)
  Top 0.15: 43.6,68.19 43.78,68.01 43.78,66.95
  Top 0.152: v52.99,18.88 50PINHEADER.33 | v45.05,32.54 45.05,34.1 43.75,35.4 43.75,66.92 43.78,66.95 | U2.3 39.5,72.08 R17.2 42.3,73.9 43.6,72.6 43.6,68.19
  Bottom 0.152: v52.99,18.88 52.99,19.88 45.05,27.82 v45.05,32.54
PSC2+  (via drill 0.3 pad 0.1, 0.35)
  Top 0.127: MCU.17 32.05,43.96 32.93,44.84 34.99,44.84 v36.13,43.7 36.61,44.19 42.42,44.19 42.97,44.73 42.97,64.04 41.9,65.11 41.9,65.14 | 50PINHEADER.11 36.89,15.1 36.89,28.7 v36.33,29.25 v36.33,29.26
  Top 0.152: IC1.1 55.89,71.12 IC1.4 52.98,68.21 v47.27,68.21 | v47.27,68.21 | 41.9,65.14 v41.9,65.95
  Bottom 0.127: v36.13,43.7 36.13,29.46 v36.33,29.26
  Bottom 0.152: v47.27,68.21 43.56,68.21 41.91,66.56 v41.91,65.96 v41.9,65.95
PSC2-  (via drill 0.35)
  Top 0.152: 50PINHEADER.31 51,20.81 v47.02,24.79 | U1.3 R19.2 59.84,69.74 56.2,66.1 46.68,66.1 45.04,64.46 45.04,41.68 45.04,41.24 44.41,40.61 v44.41,37.55
  Bottom 0.152: v47.02,24.79 44.41,27.4 v44.41,37.55
PSC_CONNECT  (via drill 0.3 pad 0.1, 0.35)
  Top 0.127: MCU.32 31.25,35.53 v30.68,34.96 | 23.98,44.76 v23.98,44.72
  Top 0.152: v23.22,64.34 23.3,64.26 23.3,45.44 23.98,44.76 | N1.2 N1.5 48.93,75.62 47.35,77.2 27.72,77.2 21.55,71.03 v21.55,71.01
  Bottom 0.127: v23.98,44.72 28.31,40.39 28.31,36.26 29.61,34.96 v30.68,34.96
  Bottom 0.152: v23.22,64.34 21.55,66.01 v21.55,71.01
PSC_DAC_SIGNAL1  (via drill 0.3 pad 0.1)
  Top 0.127: MCU.19 31.25,42.38 v30.88,42.75 | v29.49,44.12 23.6,44.12
  Top 0.152: 23.6,44.12 22.57,45.16 22.57,68.94 26.46,72.83 R16.2 26.46,73.08 29.55,76.17 43.44,76.17 47.48,72.12 R18.2
  Bottom 0.127: v30.88,42.75 29.5,44.12 v29.49,44.12
PSC_ISNS1
  Top 0.127: MCU.13 33.65,42.14 34.61,43.1 42.08,43.1 43.39,44.41 43.39,66.28 U2.1
PSC_ISNS2
  Top 0.127: MCU.18 31.65,43.05 31.19,43.51 23.69,43.51 22.18,45.02 22.18,70.97 27.85,76.64 46.46,76.64 49.05,74.05 U1.1
RESET
  Top 0.14: R2.1 18.86,18.66 19.98,18.66 28.07,26.75 FM.3
SENSE4
  Top 0.152: M1.6 M1.5 M1.2 | M1.1 M1.2 | O1.7 43.02,22.43 R8.2 43.72,23.56 44.4,24.24 45.8,24.24 47.76,22.28 M1.2
SPI_CS  (via drill 0.35)
  Top 0.127: MCU.34 v32.05,33.69
  Top 0.14: R5.1 20.37,20.54 23,23.16 FM.7 23,28.61 25.1,30.72 31.82,30.72 v32.03,30.93
  Bottom 0.14: v32.05,33.69 32.03,33.67 v32.03,30.93
SPI_MISO  (via drill 0.35)
  Top 0.127: v34.14,34.77 34.14,35.1 33.65,35.59 MCU.38
  Top 0.14: FM.8 21.73,28.57 24.71,31.56 v33.69,31.56
  Top 0.152: FM.8 21.68,27.48 R3.1
  Bottom 0.152: v34.14,34.77 34.14,32.01 v33.69,31.56
SPI_MOSI  (via drill 0.35)
  Top 0.127: MCU.39 34.05,35.85 34.94,34.96 v34.94,34.03
  Top 0.14: FM.15 29.34,15.9 30.27,14.98
  Top 0.152: R4.1 29.8,14.98 30.27,14.98 31.91,14.98 34.94,18.01 v34.94,31.26
  Bottom 0.152: v34.94,34.03 v34.94,31.26
SPI_SCK  (via drill 0.35)
  Top 0.127: MCU.33 31.65,35.2 31.34,34.89 v31.34,34.25 | v34.29,23.99 34.29,21.04 R6.1
  Top 0.152: FM.16 31.35,18.1 R6.1
  Bottom 0.127: v31.34,34.25 31.34,29.88 34.29,26.93 v34.29,23.99
SUP_3V3_1
  Top 0.152: 50PINHEADER.25 50PINHEADER.26
SUP_UNREG_1
  Top 1.016: 50PINHEADER.23 50PINHEADER.24
SUP_UNREG_2
  Top 0.152: 50PINHEADER.35 50PINHEADER.36
TMCR_I1
  Top 0.127: MCU.9 40.41,40.35 41.77,38.98 41.77,30.48 44.56,27.68 50.02,27.68 50.57,27.14 | B1:I.1 60.81,18.04 57.3,18.04 52.71,22.63 52.71,24.46 50.57,26.6 50.57,27.14 | 50.57,27.14 B1:R05.2
TMCR_I2
  Top 0.127: MCU.11 34.45,41.94 35,42.49 40.51,42.49 42.75,40.25 42.75,34.8 43.75,33.8 43.75,30.8 45.39,29.16 71.31,29.16 72.62,30.47 72.62,32.45 B2:R05.2 73.3,33.13 B2:I.1
TMCR_I3  (via drill 0.35)
  Top 0.127: v42.69,42.83 34.73,42.83 34.05,42.15 MCU.12 | v48.04,64.95 48.05,64.94 66.21,64.94 | 76.96,64.94 66.21,64.94 | A:R05.2 66.21,64.94
  Top 0.152: A:I.1 76.96,64.94
  Bottom 0.127: 42.69,42.88 44.45,44.63 44.45,63.37 46.03,64.95 v48.04,64.95
  Bottom 0.152: 42.69,42.88 v42.69,42.83
TMCR_OCP_D1  (via drill 0.35)
  Top 0.127: v40.28,33.52 35.85,37.95 MCU.3
  Top 0.152: v42.41,31.14 42.41,30.39 44.77,28.04 53.87,28.04 55.63,26.27 B1:S.2
  Bottom 0.152: v42.41,31.14 42.41,31.39 v40.28,33.52
TMCR_OCP_D2  (via drill 0.35)
  Top 0.127: v40.02,34.71 36.38,38.35 MCU.4
  Top 0.152: v42.5,32.23 43.2,31.53 43.2,30.2 44.98,28.42 58.15,28.42 B2:S.2
  Bottom 0.152: v42.5,32.23 v40.02,34.71
TMCR_OCP_D3  (via drill 0.3 pad 0.1)
  Top 0.127: MCU.5 36.46,38.75 39.05,36.16 v39.78,36.16 | v45.04,39.41 45.32,39.69 45.32,64.32 46.62,65.62 61.63,65.62 66.74,70.73 A:S.2
  Bottom 0.127: v39.78,36.16 41.79,36.16 v45.04,39.41
V+  (via drill 0.35)
  Top 0.152: R9.2 39.53,20.43 v40.39,21.29 | R8.1 39.98,22.67 v39.05,21.74 | O1.8 42.56,21.34 42.16,21.74 v41.41,21.74
  Top 1.016: 50PINHEADER.50 50PINHEADER.49
  pour POWER (isolate 0.305, rank 2): 68.25,10.35 68.25,5.8 71.03,5.8 71.03,14.05 49.69,14.05 49.69,24.8 38.03,24.8 38.03,10.45 68.2,10.45
VCC  (via drill 0.3, 0.35)
  Top 0.127: O3.8 8.47,18.5 R22.2 9.38,19.2 v9.38,17.52 | 10.43,43.42 10.43,44.88 10.73,45.19 11.1,45.19 11.97,46.06 O2.8 | 10.43,43.42 9.09,42.08 R20.2 | R21.2 11.78,42.07 10.43,43.42 | v74.32,22.46 74.97,22.46 C5.1 75.28,23.54 B2:O.8 | 67.73,23.98 67.78,23.93
  Top 0.152: B1:R01.1 71.22,20.93 v71.91,21.62 | B1:O.8 65.69,26.02 67.73,23.98 | v72.54,22.25 70.88,23.92 70.81,23.98 69.99,23.98 C4.1 67.78,23.93 | v72.63,15.83 69.75,15.83 69.05,16.54 65.29,16.54 v64.47,17.36 | v71.95,23.71 71.61,23.71 69.75,25.57 B2:R02.2 | B2:R01.1 76.43,19.73 v74.3,19.73 | CLCK.DIV 2.34,35.6 3.17,34.77 4.05,34.77 4.24,34.58 CLCK.V+ | A:O.8 79.81,69.55 79.96,69.39 81.73,69.39 82.41,70.07 C3.1 82.44,70.35 v83.6,70.35 83.6,69.45 A:R01.1 | v73.17,77.48 71.67,75.98 A:R02.2
  Top 0.254: R23.2 11,14.23 v11,14.26 | v64.78,18.67 63.15,20.3 B1:R02.2
  Top 0.305: 50PINHEADER.16 35,3.9 32.45,1.35 18,1.35 16.73,2.62 | 16.73,2.62 10.13,2.62 1.67,11.08 1.67,26.94 3.56,28.83 4.46,28.83 C22.1 | R23.2 14.05,12.88 15.62,11.31 15.62,3.73 16.73,2.62 | 10.36,39.82 10.36,30.05 9.17,28.86 C22.1 | 10.36,39.82 11.81,41.27 R21.2 | 10.36,39.82 8.75,41.43 R20.2 | CLCK.V+ 4.24,29.11 C22.1
  Top 0.813: 50PINHEADER.15 50PINHEADER.16
  Bottom 0.152: v64.78,18.67 64.47,18.36 v64.47,17.36
  Bottom 0.254: v9.38,17.52 9.38,15.9 11,14.28 v11,14.26
  pour POWER (isolate 0.406, rank 3): 33.88,10.4 36.2,10.4 36.2,5.1 71.45,5.1 71.45,89.5 94.5,89.5 94.5,-4.3 33.88,-4.3
VPP/!MCLR!_MISSION_BOSS  (via drill 0.35)
  Top 0.127: v32.67,43.62 32.45,43.4 MCU.16
  Bottom 0.152: CON-1.P$3 78.85,28.15 78.21,28.79 78.21,30.02 75.65,32.58 75.65,32.6 75.55,32.7 75.55,61.9 71.14,66.31 45.69,66.31 42.98,63.6 42.98,45.36 42.55,44.93 33.98,44.93 v32.67,43.62
VPP/!MCLR!_SFWARD
  Bottom 0.152: CON-1.P$2 74.7,29.42 73.43,28.15 71.07,28.15 60.18,17.26 60.18,14.63 58.88,13.33 55.98,13.33 55.74,13.57 53.07,13.57 52.13,12.63 24.33,12.63 50PINHEADER.1
VSSCHIP  (via drill 0.35)
  Top 0.152: LDAP.35:VSSCHIP LDAP.34:VSSCHIP LDAP.33:VSSCHIP LDAP.32:VSSCHIP LDAP.31:VSSCHIP LDAP.30:VSSCHIP LDAP.29:VSSCHIP LDAP.28:VSSCHIP LDAP.27:VSSCHIP LDAP.26:VSSCHIP 20.83,67.24 21.26,66.81 21.26,65.17 v20.97,64.88 | R31.2 14.03,54.85 14.08,54.9 v14.08,56.84
  Top 0.254: ADC1.4:AGND 13.49,56.26 v14.08,56.84 | v15.71,62.75 5.21,62.75 4.26,61.8 4.26,60.49 4.26,60.37 4.26,56.65 4.66,56.26 ADC1.13:AGND
  Bottom 0.152: v20.97,64.88 18.84,62.75 v15.71,62.75
  Bottom 0.254: v15.71,62.75 14.08,61.12 v14.08,56.84
W#
  Top 0.152: FM.9 21.73,15.63 R1.1

### Text on the board
tPlace: Z | X
bPlace: Z | X-
tNames: LDAP | ADC1 | ADC2 | Rear Access Board FM by IZ and Murase 11/10/2019
bNames: CON-1